# EAGLE schematic RADAR_Main_Board (EAGLE 7.4.0), part 2 of 3
## Sheet 3 of 4: RF
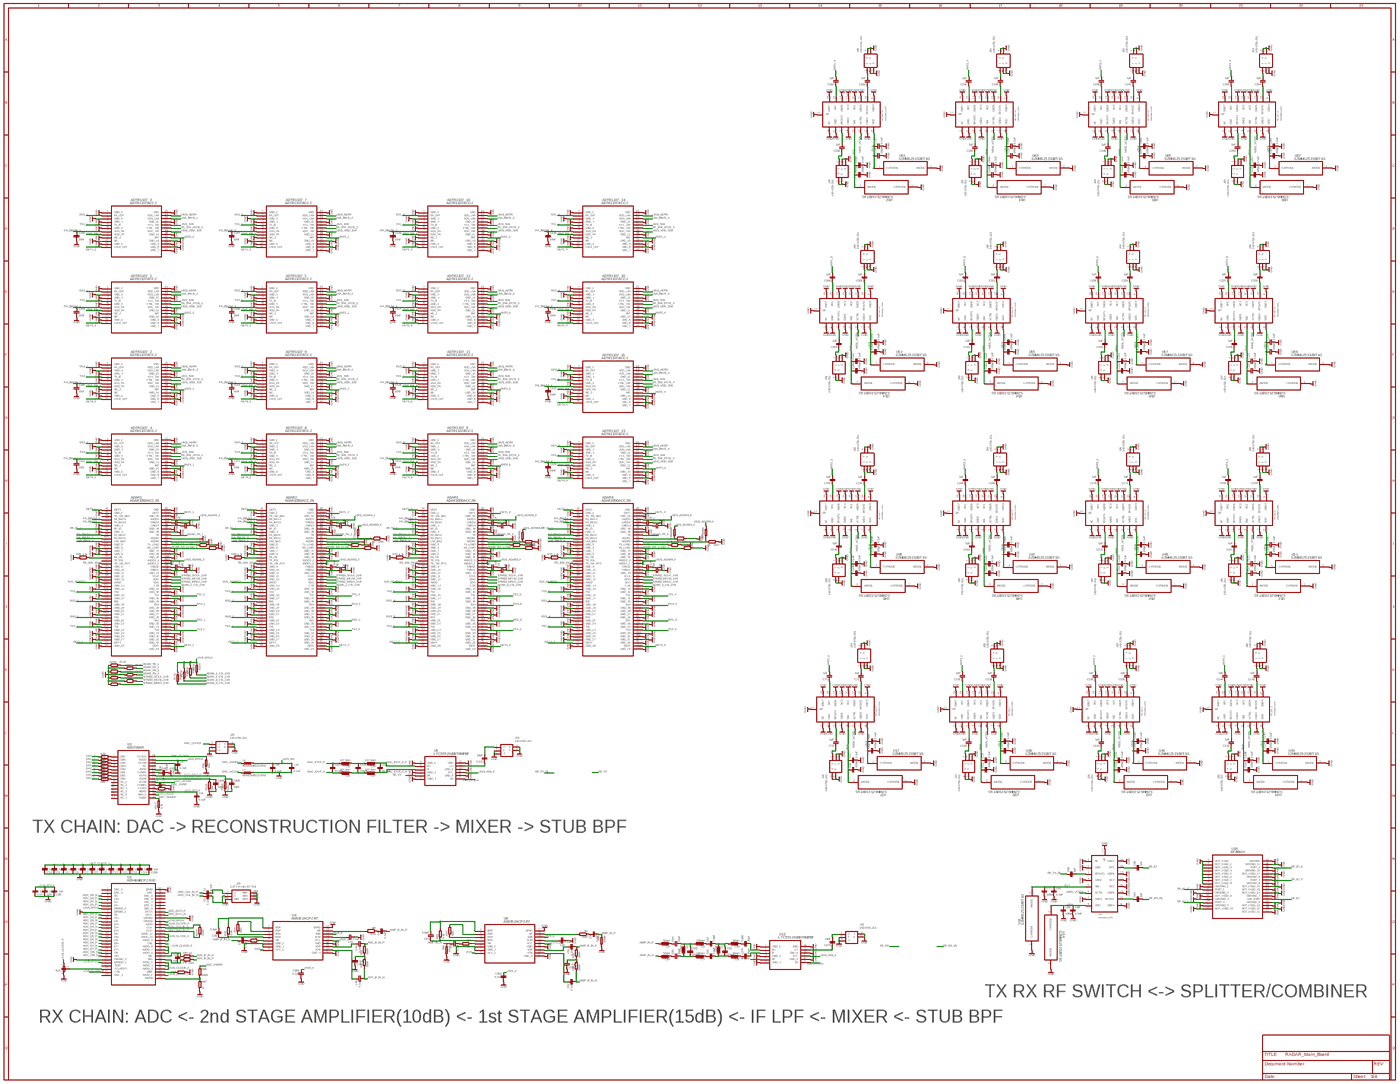
[diagram p7: schematic, sheet 3, overview]
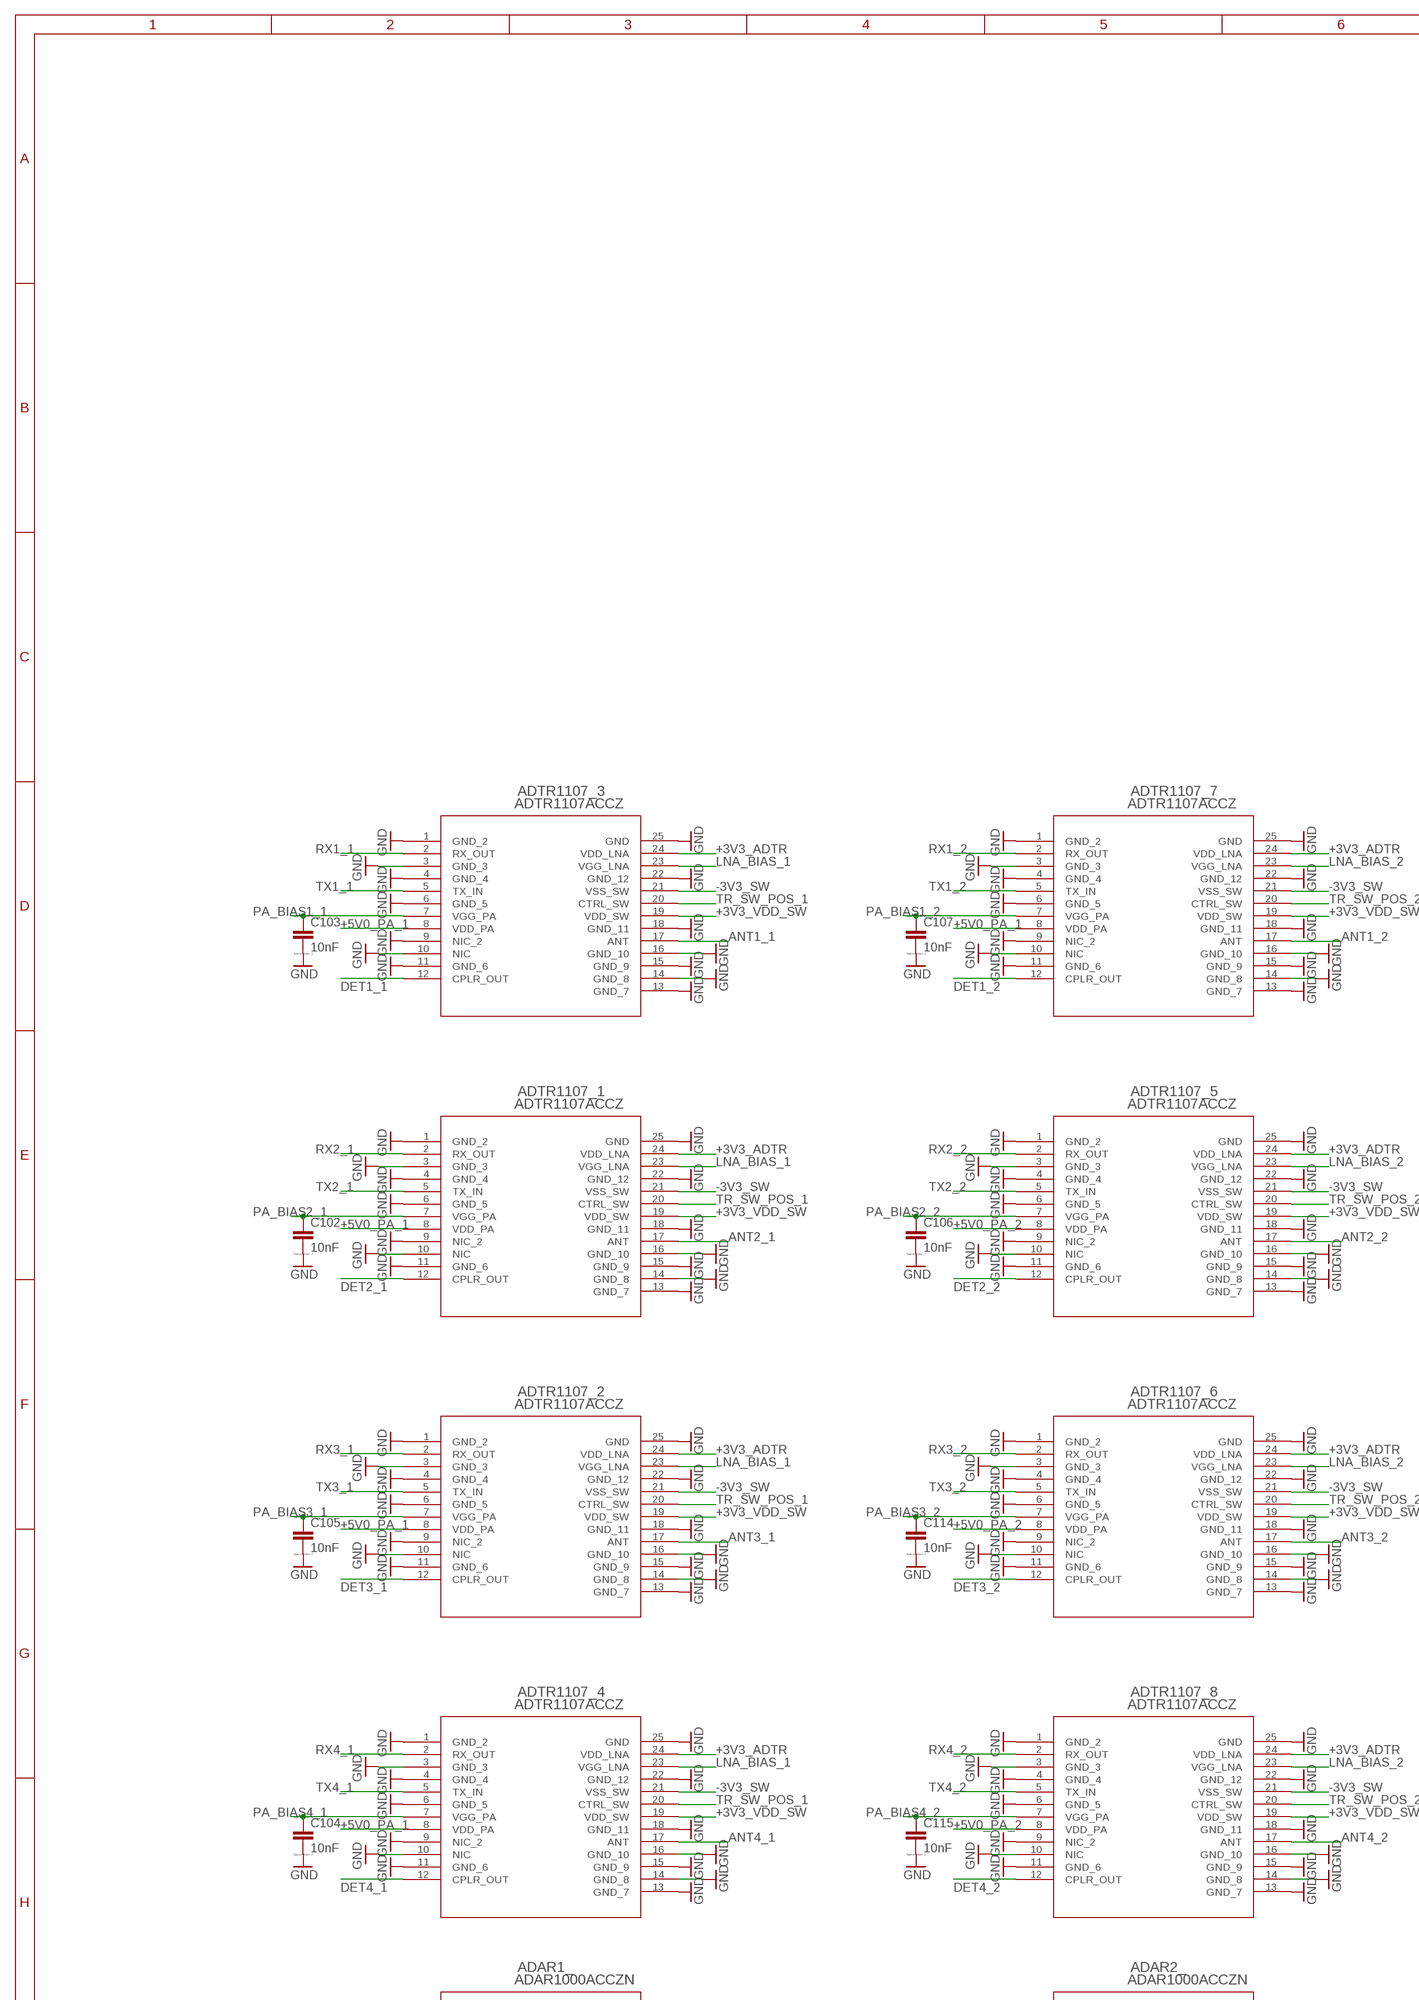
[diagram p8: schematic, sheet 3, part 1 of 8]
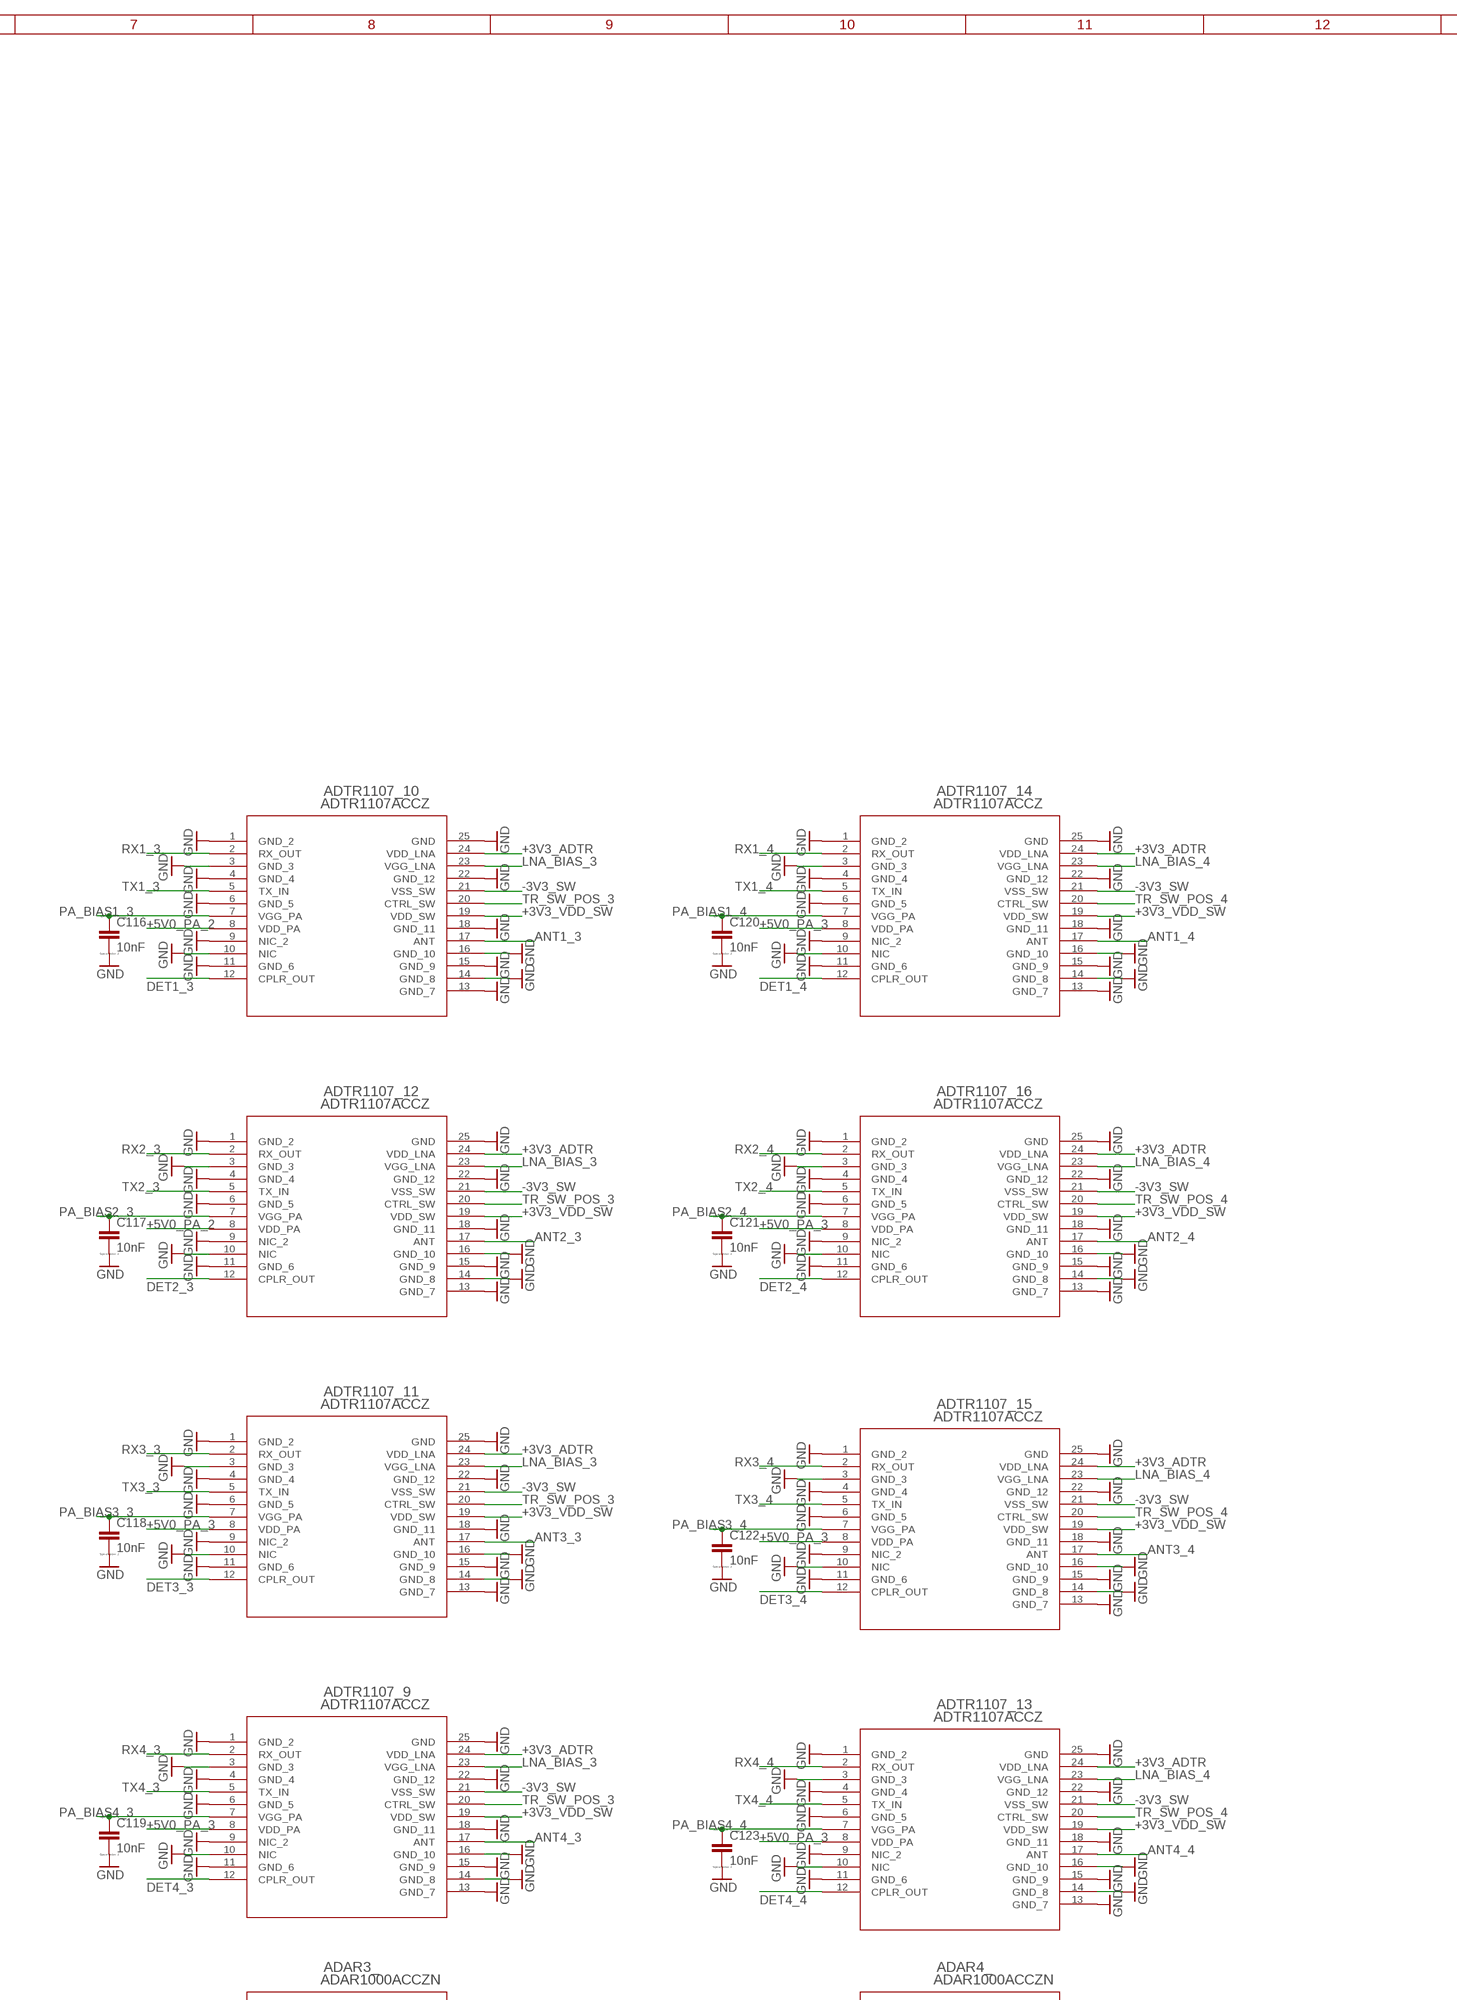
[diagram p9: schematic, sheet 3, part 2 of 8]
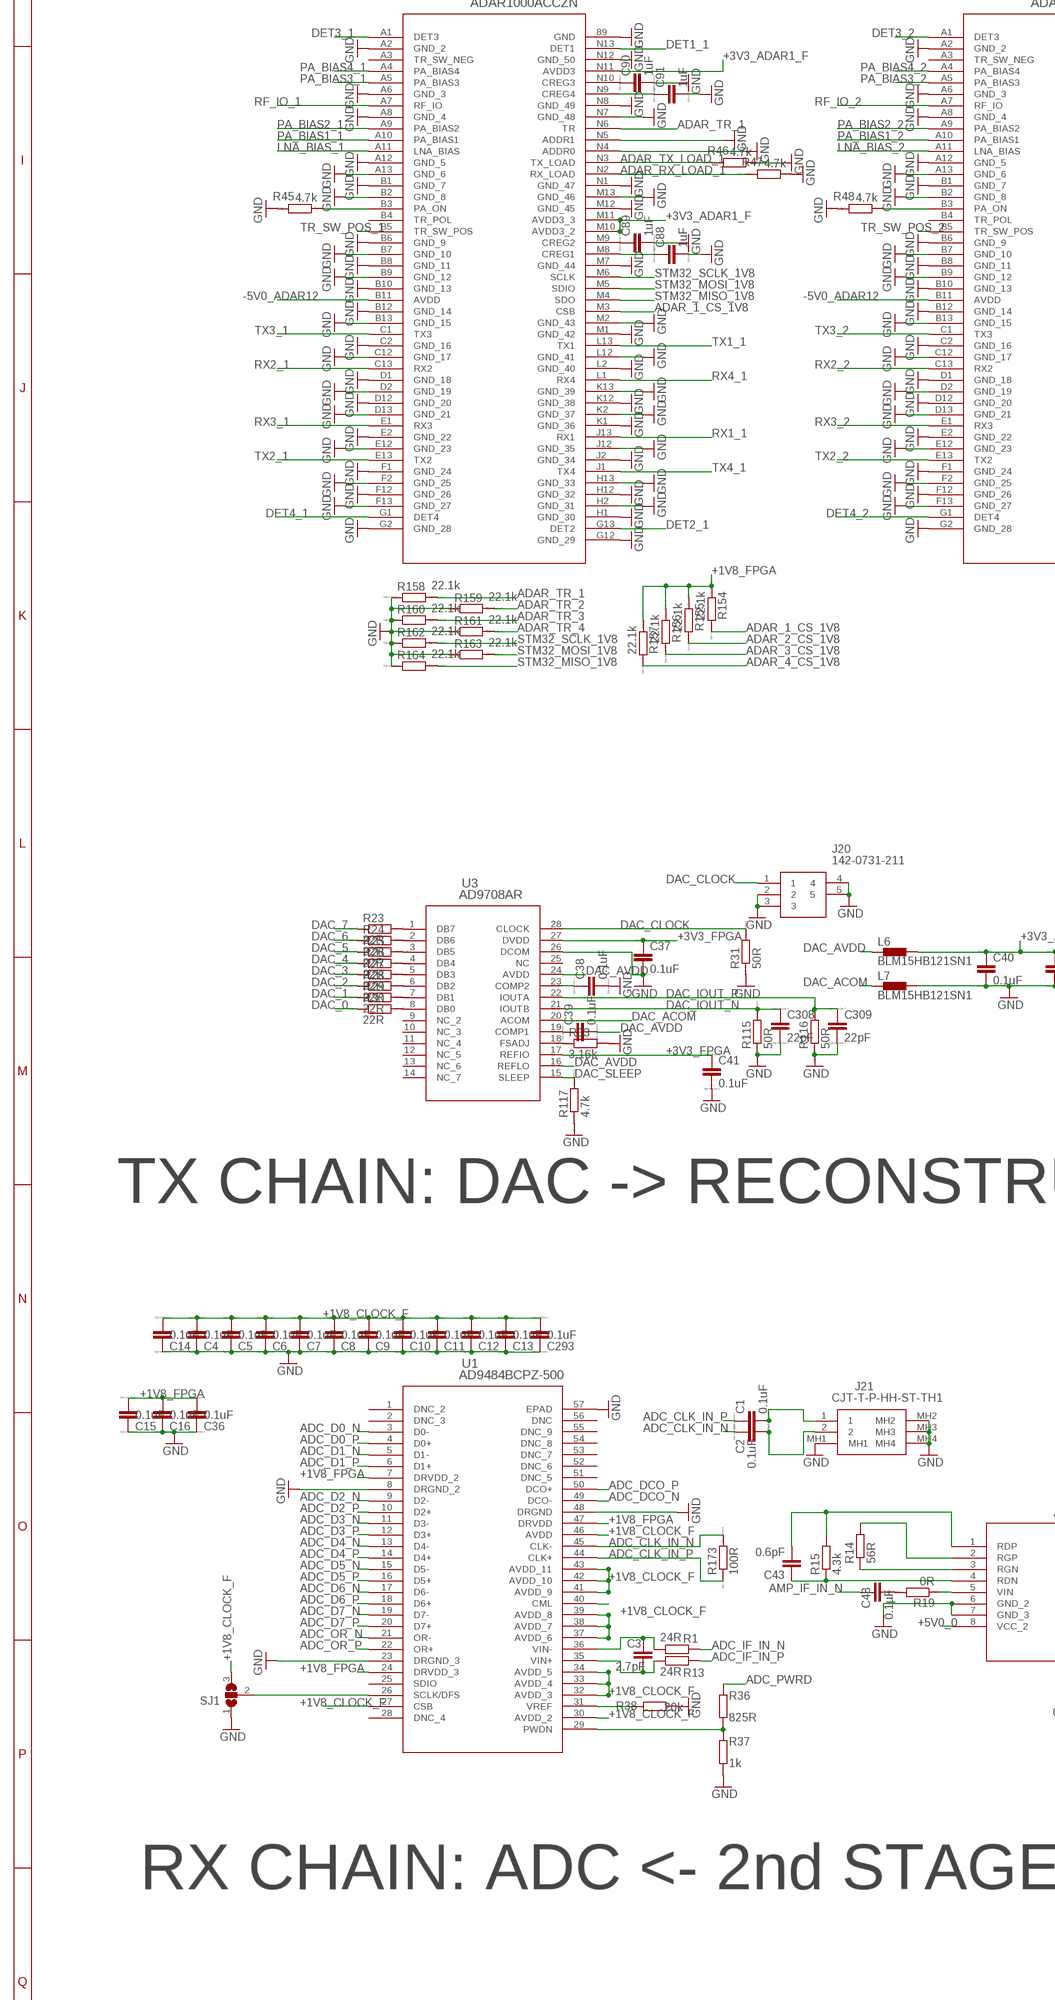
[diagram p10: schematic, sheet 3, part 3 of 8]
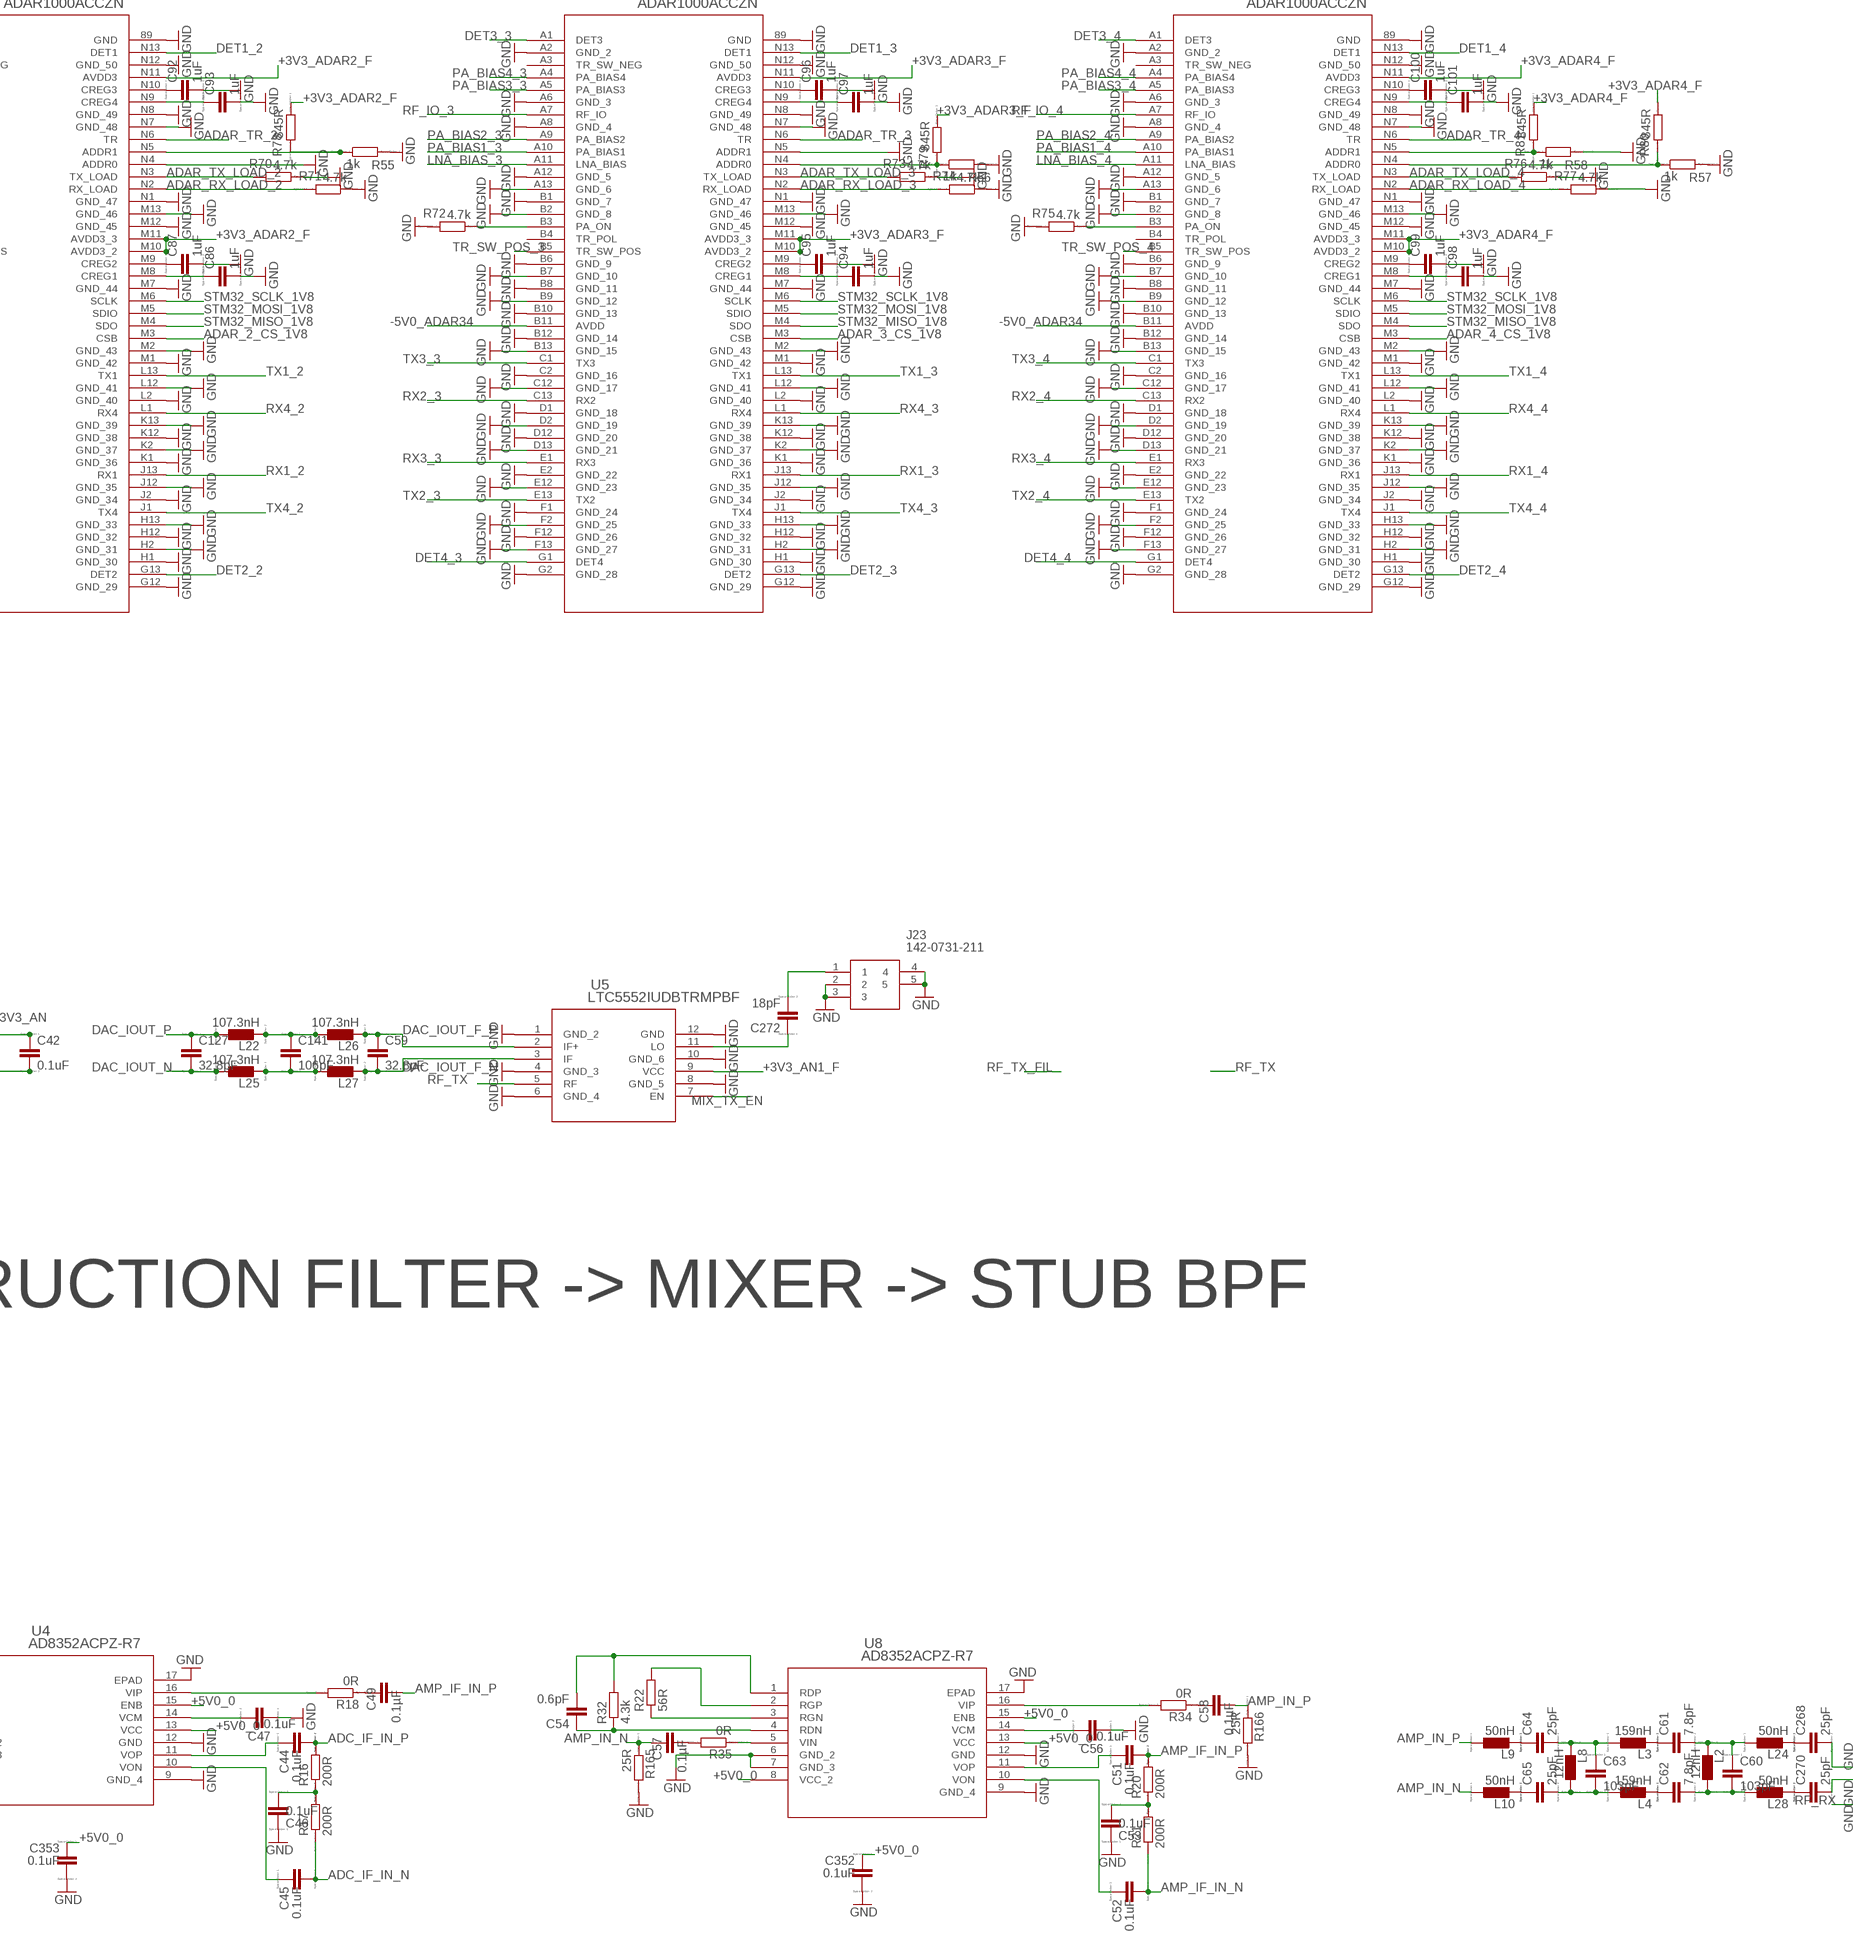
[diagram p11: schematic, sheet 3, part 4 of 8]
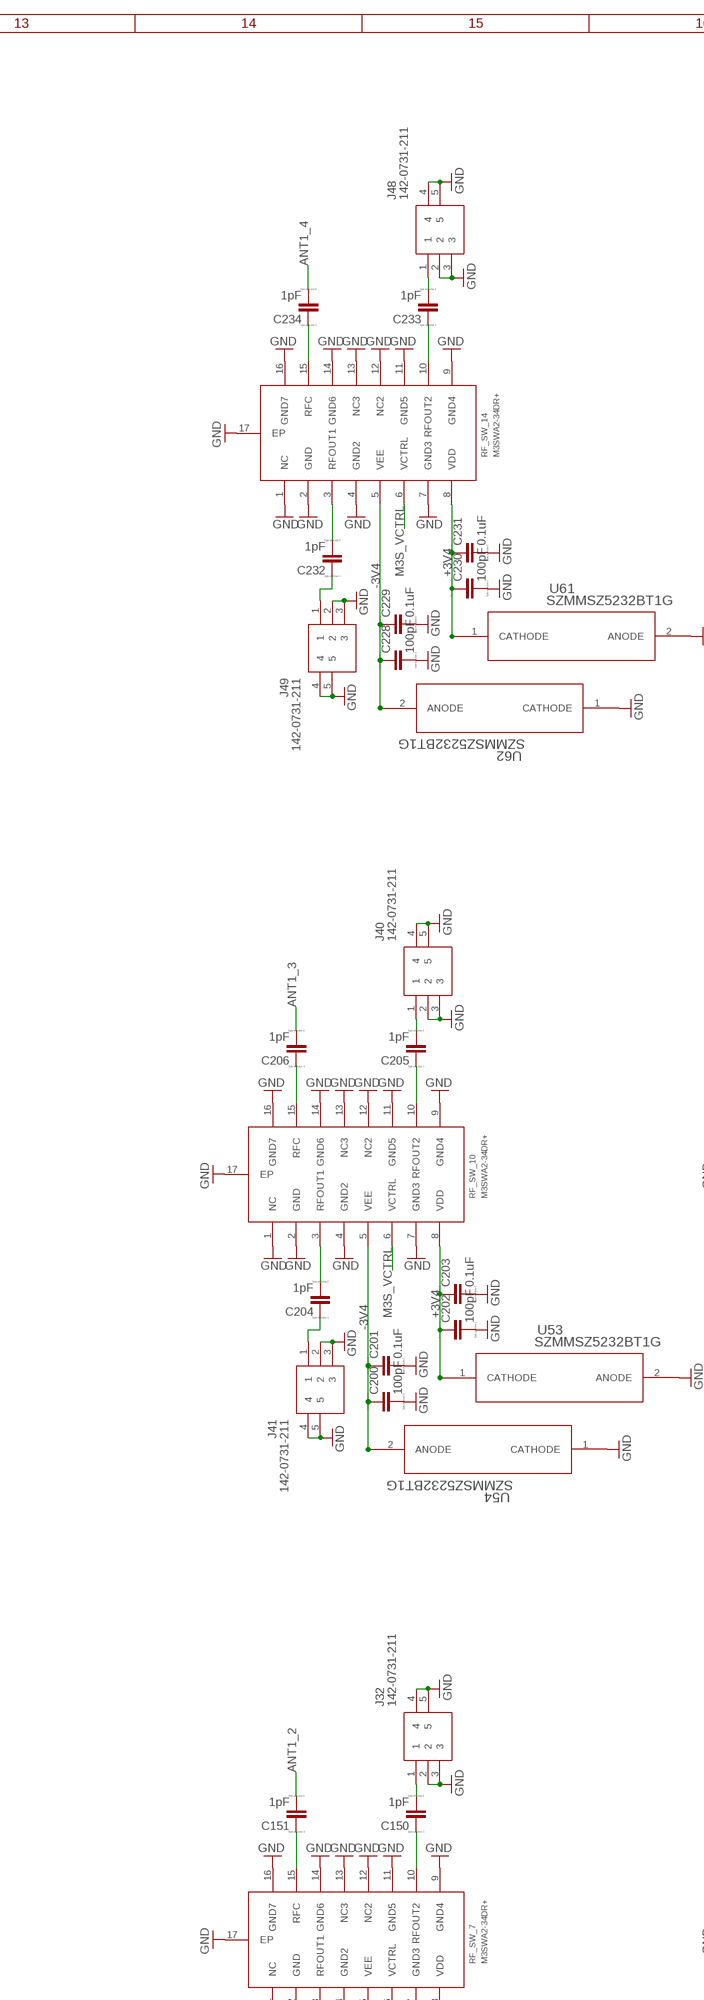
[diagram p12: schematic, sheet 3, part 5 of 8]
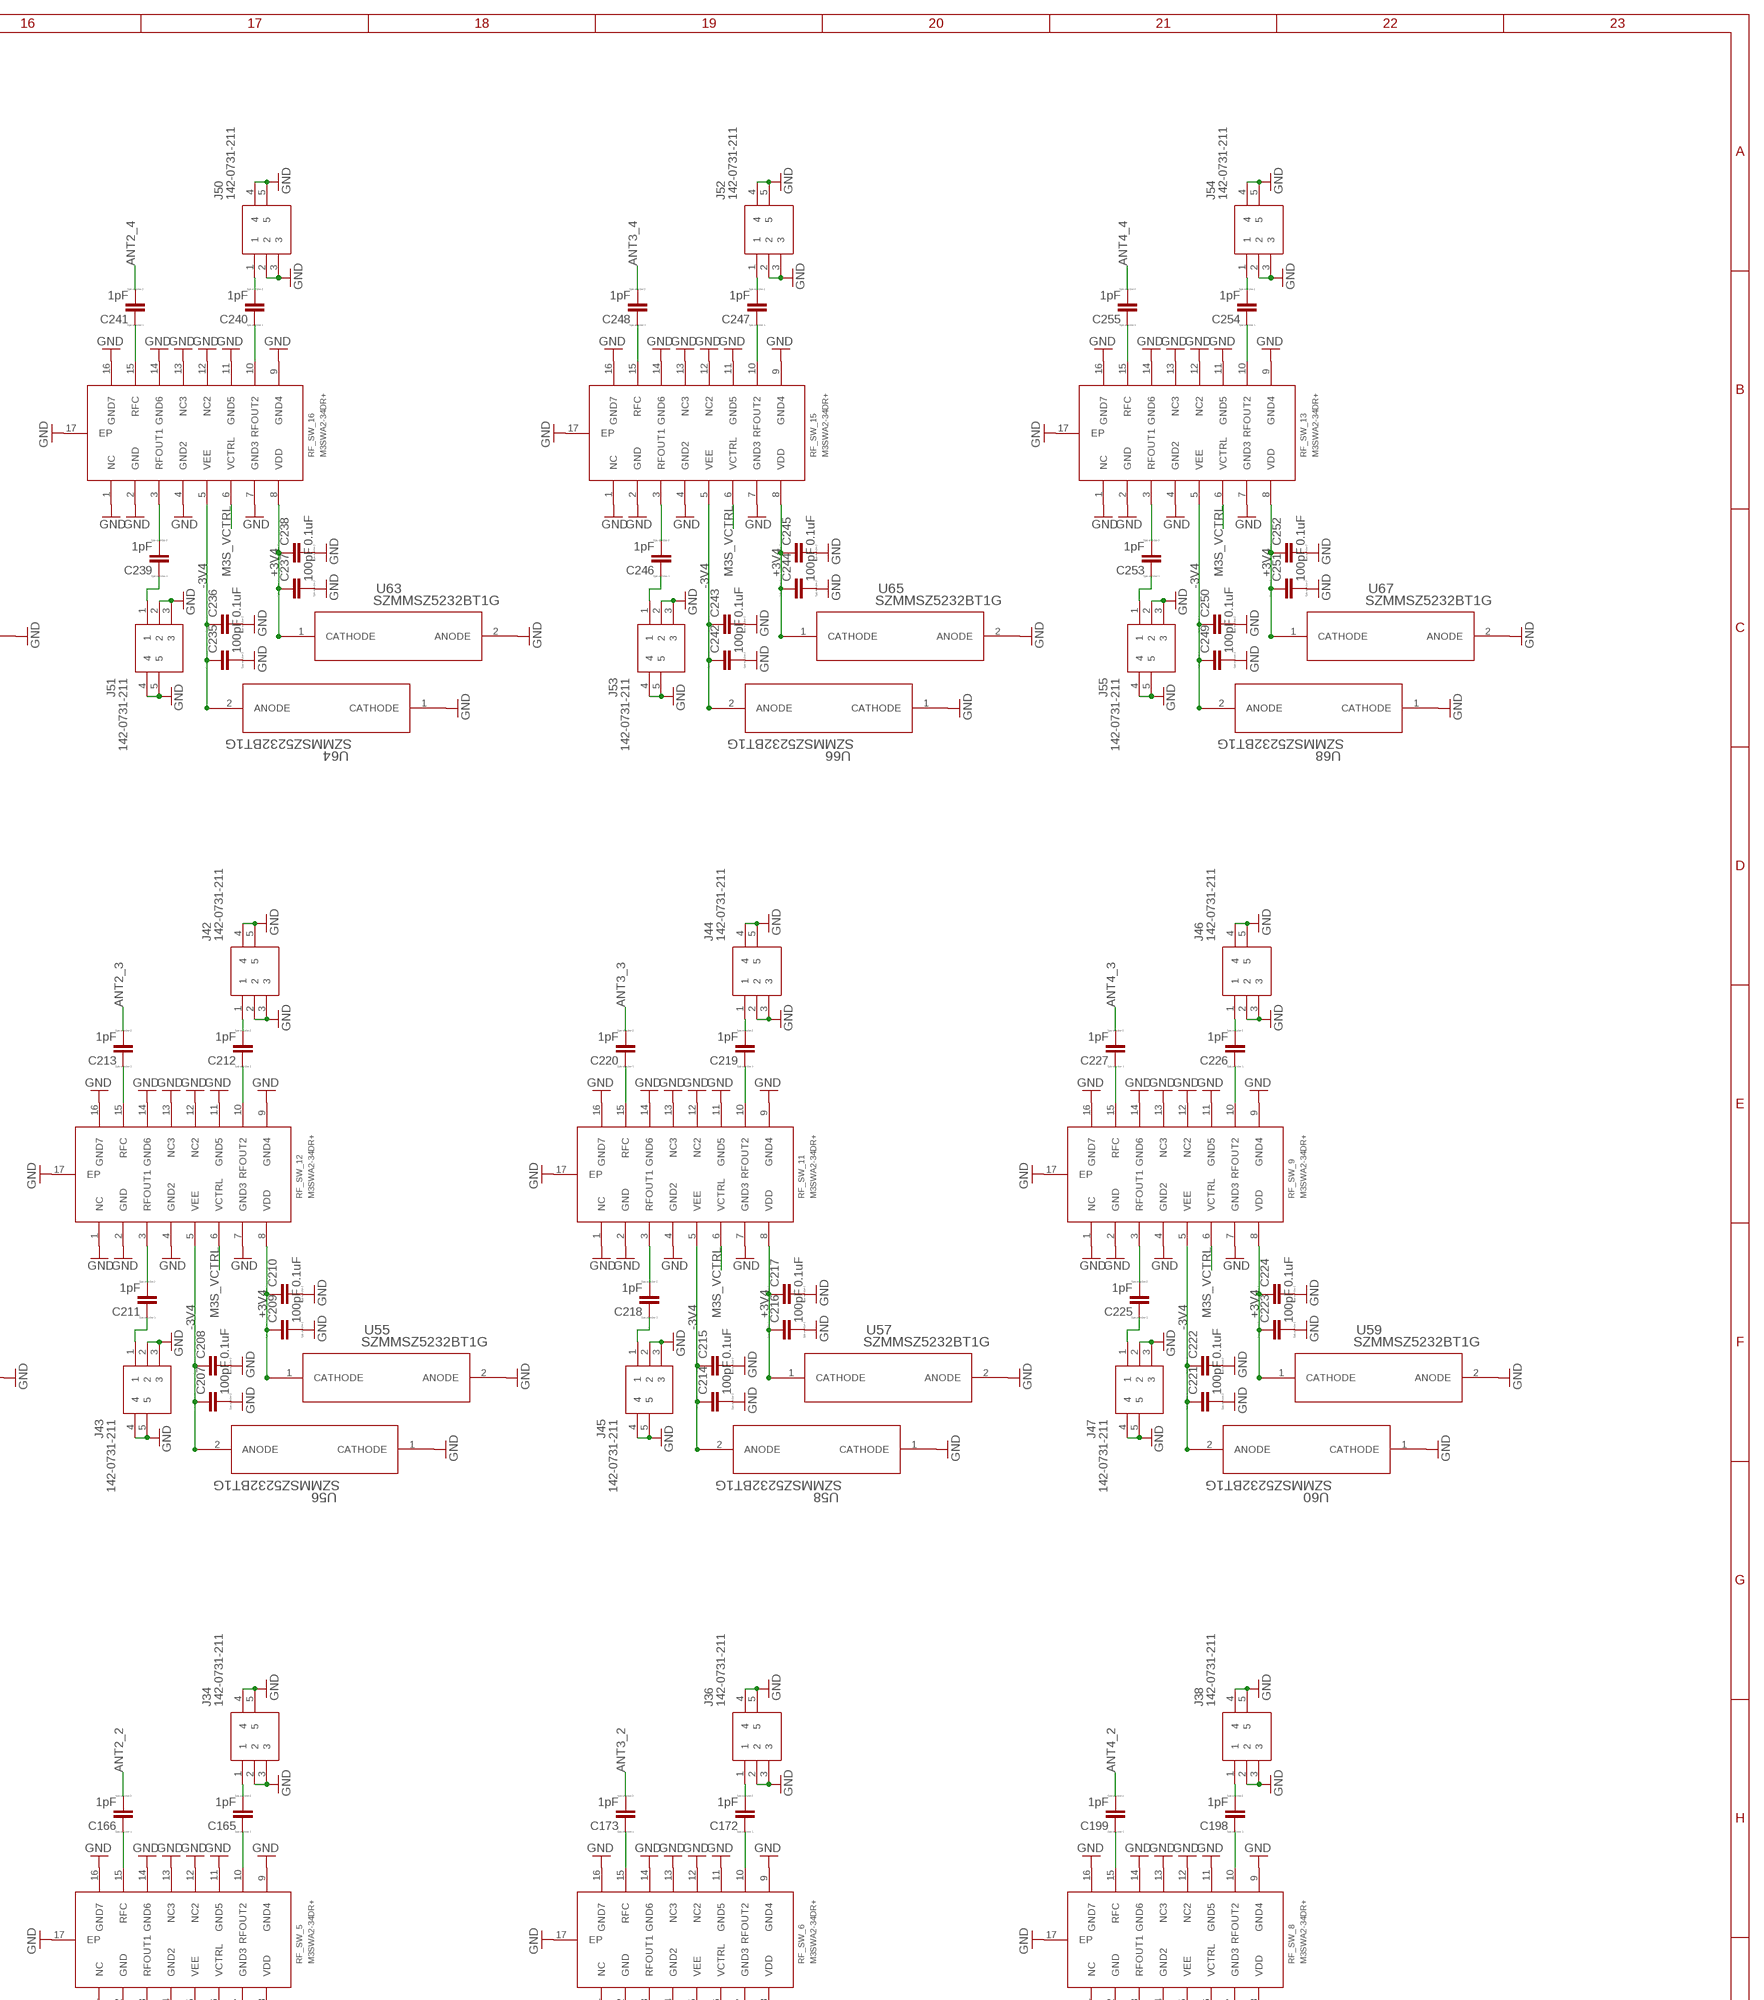
[diagram p13: schematic, sheet 3, part 6 of 8]
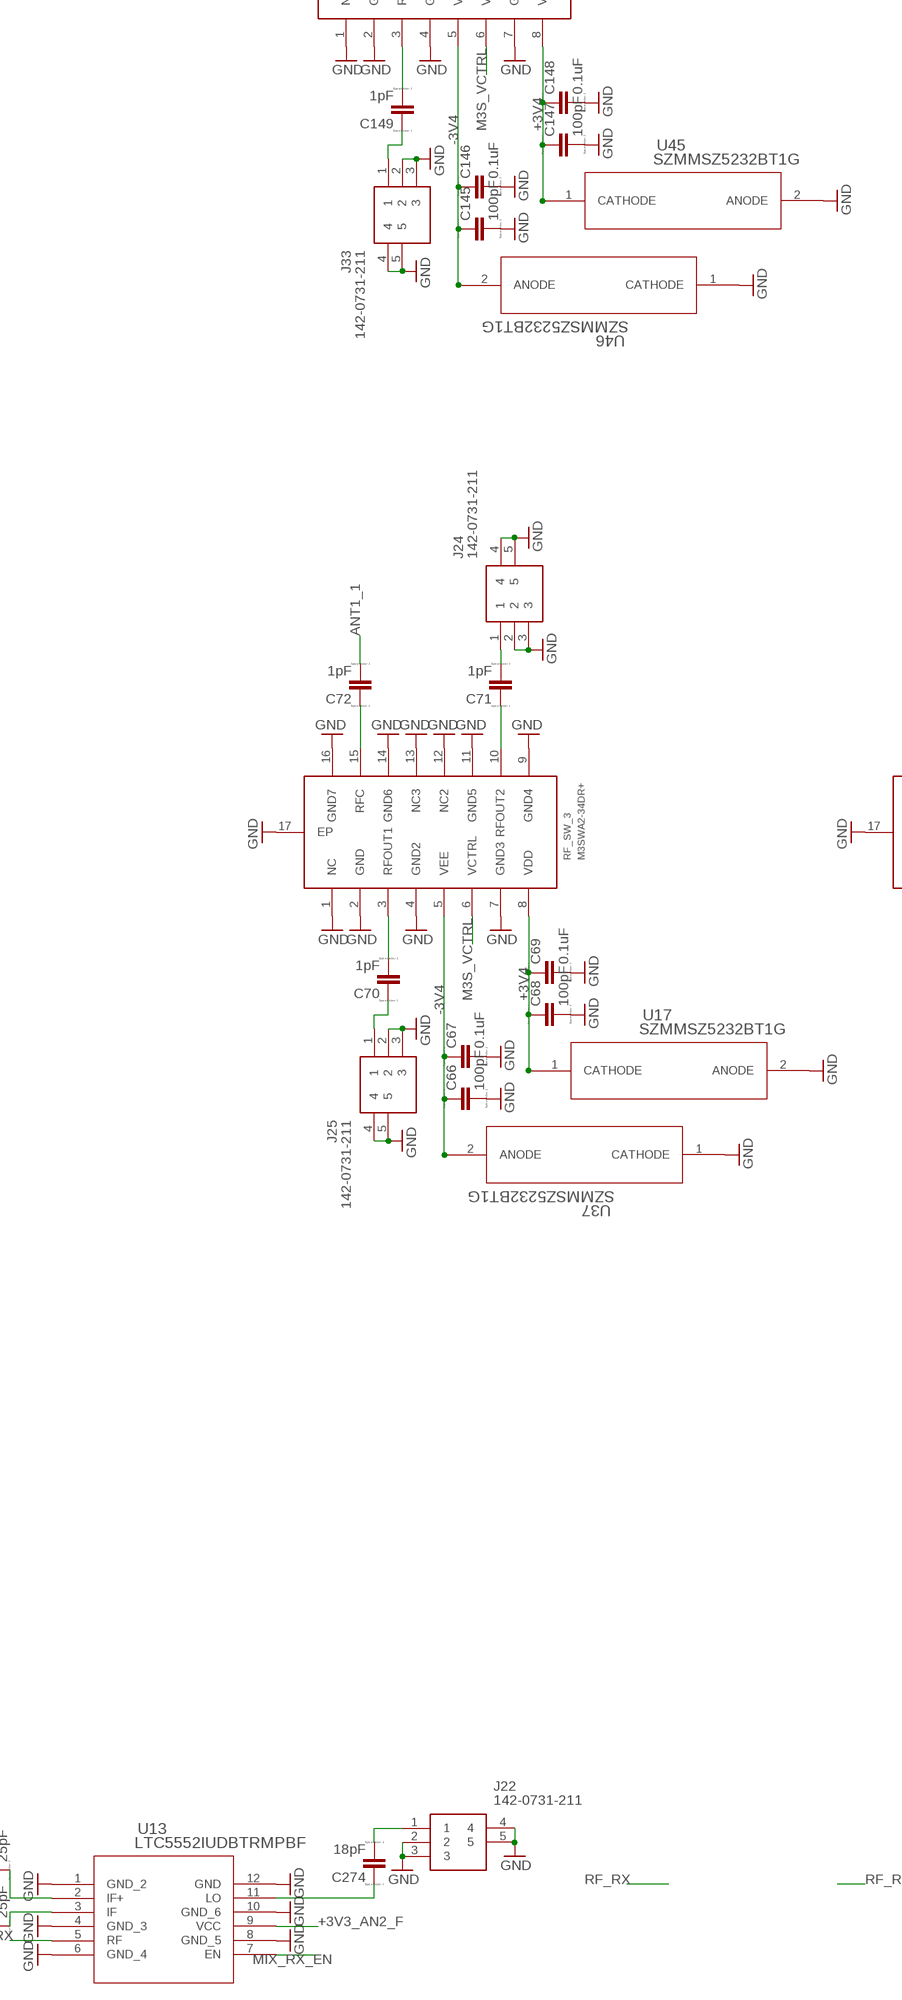
[diagram p14: schematic, sheet 3, part 7 of 8]
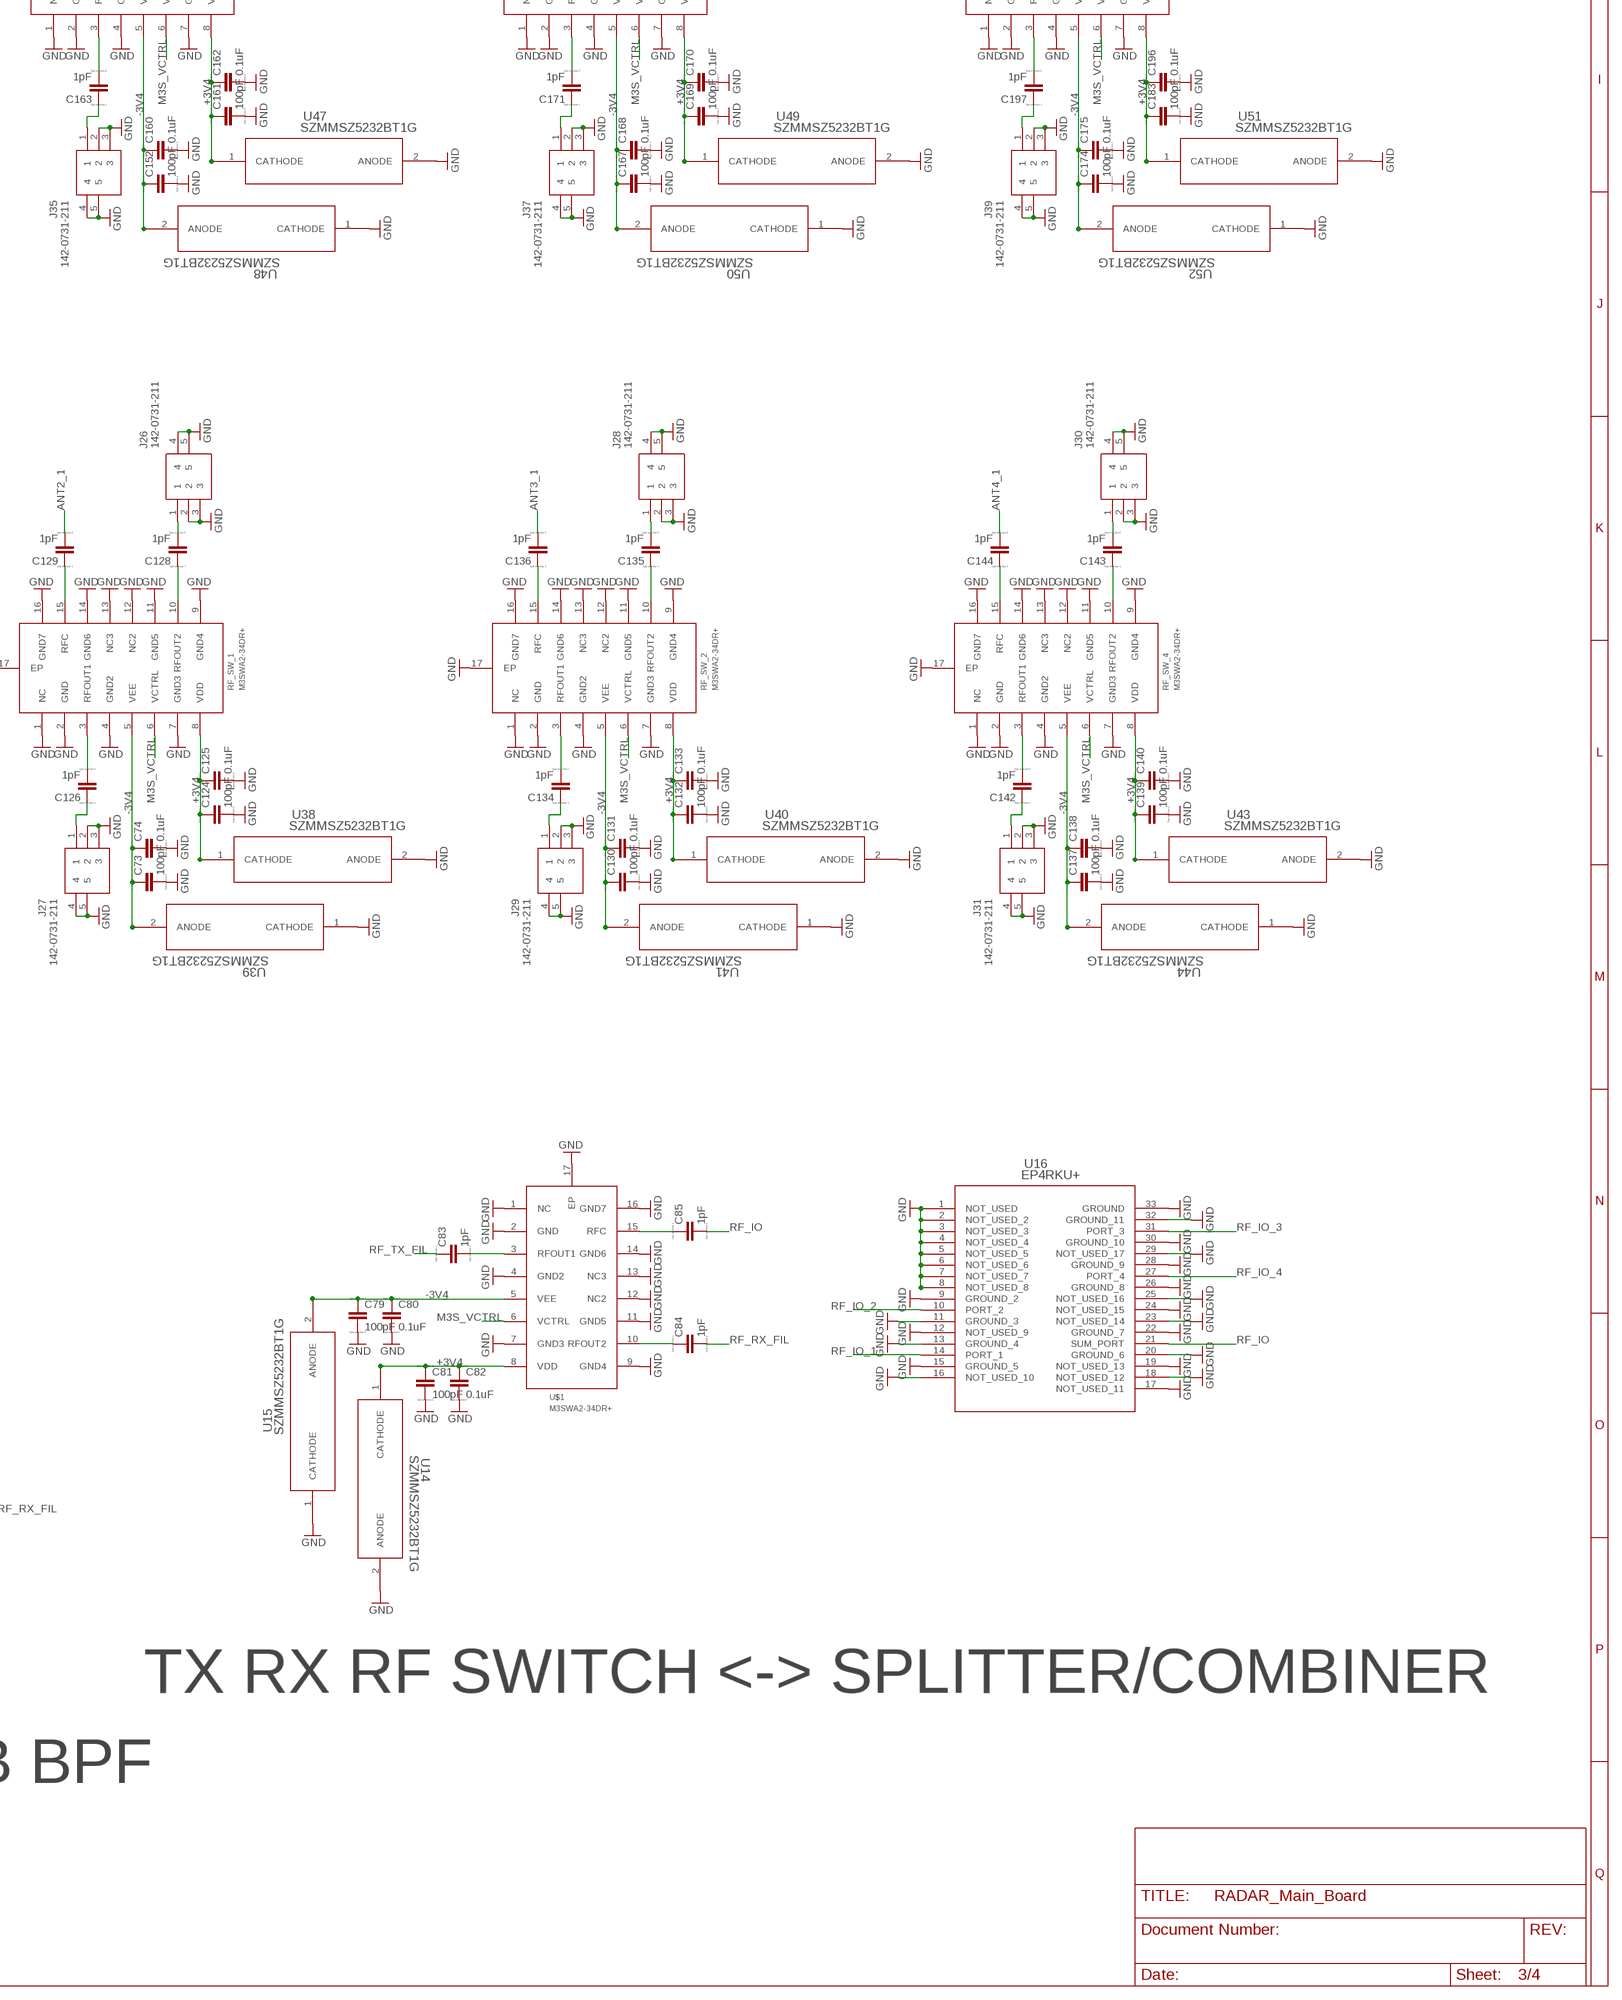
[diagram p15: schematic, sheet 3, part 8 of 8]

### Parts
ADAR1_  ADAR1000ACCZN  [CC-88-1_ADI]
ADAR2_  ADAR1000ACCZN  [CC-88-1_ADI]
ADAR3_  ADAR1000ACCZN  [CC-88-1_ADI]
ADAR4_  ADAR1000ACCZN  [CC-88-1_ADI]
ADTR1107_1  ADTR1107ACCZ  [CC-24-8_ADI]
ADTR1107_2  ADTR1107ACCZ  [CC-24-8_ADI]
ADTR1107_3  ADTR1107ACCZ  [CC-24-8_ADI]
ADTR1107_4  ADTR1107ACCZ  [CC-24-8_ADI]
ADTR1107_5  ADTR1107ACCZ  [CC-24-8_ADI]
ADTR1107_6  ADTR1107ACCZ  [CC-24-8_ADI]
ADTR1107_7  ADTR1107ACCZ  [CC-24-8_ADI]
ADTR1107_8  ADTR1107ACCZ  [CC-24-8_ADI]
ADTR1107_9  ADTR1107ACCZ  [CC-24-8_ADI]
ADTR1107_10  ADTR1107ACCZ  [CC-24-8_ADI]
ADTR1107_11  ADTR1107ACCZ  [CC-24-8_ADI]
ADTR1107_12  ADTR1107ACCZ  [CC-24-8_ADI]
ADTR1107_13  ADTR1107ACCZ  [CC-24-8_ADI]
ADTR1107_14  ADTR1107ACCZ  [CC-24-8_ADI]
ADTR1107_15  ADTR1107ACCZ  [CC-24-8_ADI]
ADTR1107_16  ADTR1107ACCZ  [CC-24-8_ADI]
C1  0.1uF  CC0201  [C0201]
C2  0.1uF  CC0201  [C0201]
C3  2.7pF  C-EUC0402  [C0402]
C4  0.1uF  CC0201  [C0201]
C5  0.1uF  CC0201  [C0201]
C6  0.1uF  CC0201  [C0201]
C7  0.1uF  CC0201  [C0201]
C8  0.1uF  CC0201  [C0201]
C9  0.1uF  CC0201  [C0201]
C10  0.1uF  CC0201  [C0201]
C11  0.1uF  CC0201  [C0201]
C12  0.1uF  CC0201  [C0201]
C13  0.1uF  CC0201  [C0201]
C14  0.1uF  CC0201  [C0201]
C15  0.1uF  CC0201  [C0201]
C16  0.1uF  CC0201  [C0201]
C36  0.1uF  CC0201  [C0201]
C37  0.1uF  CC0201  [C0201]
C38  0.1uF  CC0201  [C0201]
C39  0.1uF  CC0201  [C0201]
C40  0.1uF  CC0201  [C0201]
C41  0.1uF  CC0201  [C0201]
C42  0.1uF  CC0201  [C0201]
C43  0.6pF  C-EUC0201  [C0201]
C44  0.1uF  CC0201  [C0201]
C45  0.1uF  CC0201  [C0201]
C46  0.1uF  CC0201  [C0201]
C47  0.1uF  CC0201  [C0201]
C48  0.1µF  C-EUC0402  [C0402]
C49  0.1µF  C-EUC0402  [C0402]
C51  0.1uF  CC0201  [C0201]
C52  0.1uF  CC0201  [C0201]
C53  0.1uF  CC0201  [C0201]
C54  0.6pF  C-EUC0201  [C0201]
C56  0.1uF  CC0201  [C0201]
C57  0.1µF  C-EUC0402  [C0402]
C58  0.1µF  C-EUC0402  [C0402]
C59  32.8pF  CC0201  [C0201]
C60  103pF  CC0201  [C0201]
C61  7.8pF  CC0201  [C0201]
C62  7.8pF  CC0201  [C0201]
C63  103pF  CC0201  [C0201]
C64  25pF  CC0201  [C0201]
C65  25pF  CC0201  [C0201]
C66  100pF  CC0201  [C0201]
C67  0.1uF  CC0201  [C0201]
C68  100pF  CC0201  [C0201]
C69  0.1uF  CC0201  [C0201]
C70  1pF  CC0201  [C0201]
C71  1pF  CC0201  [C0201]
C72  1pF  CC0201  [C0201]
C73  100pF  CC0201  [C0201]
C74  0.1uF  CC0201  [C0201]
C79  100pF  CC0201  [C0201]
C80  0.1uF  CC0201  [C0201]
C81  100pF  CC0201  [C0201]
C82  0.1uF  CC0201  [C0201]
C83  1pF  CC0201  [C0201]
C84  1pF  CC0201  [C0201]
C85  1pF  CC0201  [C0201]
C86  1uF  CC0201  [C0201]
C87  1uF  CC0201  [C0201]
C88  1uF  CC0201  [C0201]
C89  1uF  CC0201  [C0201]
C90  1uF  CC0201  [C0201]
C91  1uF  CC0201  [C0201]
C92  1uF  CC0201  [C0201]
C93  1uF  CC0201  [C0201]
C94  1uF  CC0201  [C0201]
C95  1uF  CC0201  [C0201]
C96  1uF  CC0201  [C0201]
C97  1uF  CC0201  [C0201]
C98  1uF  CC0201  [C0201]
C99  1uF  CC0201  [C0201]
C100  1uF  CC0201  [C0201]
C101  1uF  CC0201  [C0201]
C102  10nF  CC0201  [C0201]
C103  10nF  CC0201  [C0201]
C104  10nF  CC0201  [C0201]
C105  10nF  CC0201  [C0201]
C106  10nF  CC0201  [C0201]
C107  10nF  CC0201  [C0201]
C114  10nF  CC0201  [C0201]
C115  10nF  CC0201  [C0201]
C116  10nF  CC0201  [C0201]
C117  10nF  CC0201  [C0201]
C118  10nF  CC0201  [C0201]
C119  10nF  CC0201  [C0201]
C120  10nF  CC0201  [C0201]
C121  10nF  CC0201  [C0201]
C122  10nF  CC0201  [C0201]
C123  10nF  CC0201  [C0201]
C124  100pF  CC0201  [C0201]
C125  0.1uF  CC0201  [C0201]
C126  1pF  CC0201  [C0201]
C127  32.8pF  CC0201  [C0201]
C128  1pF  CC0201  [C0201]
C129  1pF  CC0201  [C0201]
C130  100pF  CC0201  [C0201]
C131  0.1uF  CC0201  [C0201]
C132  100pF  CC0201  [C0201]
C133  0.1uF  CC0201  [C0201]
C134  1pF  CC0201  [C0201]
C135  1pF  CC0201  [C0201]
C136  1pF  CC0201  [C0201]
C137  100pF  CC0201  [C0201]
C138  0.1uF  CC0201  [C0201]
C139  100pF  CC0201  [C0201]
C140  0.1uF  CC0201  [C0201]
C141  106pF  CC0201  [C0201]
C142  1pF  CC0201  [C0201]
C143  1pF  CC0201  [C0201]
C144  1pF  CC0201  [C0201]
C145  100pF  CC0201  [C0201]
C146  0.1uF  CC0201  [C0201]
C147  100pF  CC0201  [C0201]
C148  0.1uF  CC0201  [C0201]
C149  1pF  CC0201  [C0201]
C150  1pF  CC0201  [C0201]
C151  1pF  CC0201  [C0201]
C152  100pF  CC0201  [C0201]
C160  0.1uF  CC0201  [C0201]
C161  100pF  CC0201  [C0201]
C162  0.1uF  CC0201  [C0201]
C163  1pF  CC0201  [C0201]
C165  1pF  CC0201  [C0201]
C166  1pF  CC0201  [C0201]
C167  100pF  CC0201  [C0201]
C168  0.1uF  CC0201  [C0201]
C169  100pF  CC0201  [C0201]
C170  0.1uF  CC0201  [C0201]
C171  1pF  CC0201  [C0201]
C172  1pF  CC0201  [C0201]
C173  1pF  CC0201  [C0201]
C174  100pF  CC0201  [C0201]
C175  0.1uF  CC0201  [C0201]
C183  100pF  CC0201  [C0201]
C196  0.1uF  CC0201  [C0201]
C197  1pF  CC0201  [C0201]
C198  1pF  CC0201  [C0201]
C199  1pF  CC0201  [C0201]
C200  100pF  CC0201  [C0201]
C201  0.1uF  CC0201  [C0201]
C202  100pF  CC0201  [C0201]
C203  0.1uF  CC0201  [C0201]
C204  1pF  CC0201  [C0201]
C205  1pF  CC0201  [C0201]
C206  1pF  CC0201  [C0201]
C207  100pF  CC0201  [C0201]
C208  0.1uF  CC0201  [C0201]
C209  100pF  CC0201  [C0201]
C210  0.1uF  CC0201  [C0201]
C211  1pF  CC0201  [C0201]
C212  1pF  CC0201  [C0201]
C213  1pF  CC0201  [C0201]
C214  100pF  CC0201  [C0201]
C215  0.1uF  CC0201  [C0201]
C216  100pF  CC0201  [C0201]
C217  0.1uF  CC0201  [C0201]
C218  1pF  CC0201  [C0201]
C219  1pF  CC0201  [C0201]
C220  1pF  CC0201  [C0201]
C221  100pF  CC0201  [C0201]
C222  0.1uF  CC0201  [C0201]
C223  100pF  CC0201  [C0201]
C224  0.1uF  CC0201  [C0201]
C225  1pF  CC0201  [C0201]
C226  1pF  CC0201  [C0201]
C227  1pF  CC0201  [C0201]
C228  100pF  CC0201  [C0201]
C229  0.1uF  CC0201  [C0201]
C230  100pF  CC0201  [C0201]
C231  0.1uF  CC0201  [C0201]
C232  1pF  CC0201  [C0201]
C233  1pF  CC0201  [C0201]
C234  1pF  CC0201  [C0201]
C235  100pF  CC0201  [C0201]
C236  0.1uF  CC0201  [C0201]
C237  100pF  CC0201  [C0201]
C238  0.1uF  CC0201  [C0201]
C239  1pF  CC0201  [C0201]
C240  1pF  CC0201  [C0201]
C241  1pF  CC0201  [C0201]
C242  100pF  CC0201  [C0201]
C243  0.1uF  CC0201  [C0201]
C244  100pF  CC0201  [C0201]
C245  0.1uF  CC0201  [C0201]
C246  1pF  CC0201  [C0201]
C247  1pF  CC0201  [C0201]
C248  1pF  CC0201  [C0201]
C249  100pF  CC0201  [C0201]
C250  0.1uF  CC0201  [C0201]
C251  100pF  CC0201  [C0201]
C252  0.1uF  CC0201  [C0201]
C253  1pF  CC0201  [C0201]
C254  1pF  CC0201  [C0201]
C255  1pF  CC0201  [C0201]
C268  25pF  CC0201  [C0201]
C270  25pF  CC0201  [C0201]
C272  18pF  CC0201  [C0201]
C274  18pF  CC0201  [C0201]
C293  0.1uF  CC0201  [C0201]
C308  22pF  CC0201  [C0201]
C309  22pF  CC0201  [C0201]
C352  0.1uF  CC0201  [C0201]
C353  0.1uF  CC0201  [C0201]
J20  142-0731-211  [1420731211]
J21  CJT-T-P-HH-ST-TH1  [CJTTPHHSTTH1]
J22  142-0731-211  [1420731211]
J23  142-0731-211  [1420731211]
J24  142-0731-211  [1420731211]
J25  142-0731-211  [1420731211]
J26  142-0731-211  [1420731211]
J27  142-0731-211  [1420731211]
J28  142-0731-211  [1420731211]
J29  142-0731-211  [1420731211]
J30  142-0731-211  [1420731211]
J31  142-0731-211  [1420731211]
J32  142-0731-211  [1420731211]
J33  142-0731-211  [1420731211]
J34  142-0731-211  [1420731211]
J35  142-0731-211  [1420731211]
J36  142-0731-211  [1420731211]
J37  142-0731-211  [1420731211]
J38  142-0731-211  [1420731211]
J39  142-0731-211  [1420731211]
J40  142-0731-211  [1420731211]
J41  142-0731-211  [1420731211]
J42  142-0731-211  [1420731211]
J43  142-0731-211  [1420731211]
J44  142-0731-211  [1420731211]
J45  142-0731-211  [1420731211]
J46  142-0731-211  [1420731211]
J47  142-0731-211  [1420731211]
J48  142-0731-211  [1420731211]
J49  142-0731-211  [1420731211]
J50  142-0731-211  [1420731211]
J51  142-0731-211  [1420731211]
J52  142-0731-211  [1420731211]
J53  142-0731-211  [1420731211]
J54  142-0731-211  [1420731211]
J55  142-0731-211  [1420731211]
L2  12nH  LL0201  [L0201]
L3  159nH  LL0201  [L0201]
L4  159nH  LL0201  [L0201]
L6  BLM15HB121SN1  [0402]
L7  BLM15HB121SN1  [0402]
L8  12nH  LL0201  [L0201]
L9  50nH  LL0201  [L0201]
L10  50nH  LL0201  [L0201]
L22  107.3nH  LL0201  [L0201]
L24  50nH  LL0201  [L0201]
L25  107.3nH  LL0201  [L0201]
L26  107.3nH  LL0201  [L0201]
L27  107.3nH  LL0201  [L0201]
L28  50nH  LL0201  [L0201]
R1  24R  R-EU_R0402  [R0402]
R13  24R  R-EU_R0402  [R0402]
R14  56R  R-EU_R0201  [R0201]
R15  4.3k  R-EU_R0201  [R0201]
R16  200R  RR0201  [R0201]
R17  200R  RR0201  [R0201]
R18  0R  RR0201  [R0201]
R19  0R  RR0201  [R0201]
R20  200R  RR0201  [R0201]
R21  200R  RR0201  [R0201]
R22  56R  R-EU_R0201  [R0201]
R23  22R  RR0201  [R0201]
R24  22R  RR0201  [R0201]
R25  22R  RR0201  [R0201]
R26  22R  RR0201  [R0201]
R27  22R  RR0201  [R0201]
R28  22R  RR0201  [R0201]
R29  22R  RR0201  [R0201]
R30  22R  RR0201  [R0201]
R31  50R  RR0201  [R0201]
R32  4.3k  R-EU_R0201  [R0201]
R33  3.16k  RR0201  [R0201]
R34  0R  RR0201  [R0201]
R35  0R  RR0201  [R0201]
R36  825R  R-EU_R0402  [R0402]
R37  1k  R-EU_R0402  [R0402]
R38  20k  R-EU_R0402  [R0402]
R45  4.7k  RR0201  [R0201]
R46  4.7k  RR0201  [R0201]
R47  4.7k  RR0201  [R0201]
R48  4.7k  RR0201  [R0201]
R55  1k  RR0201  [R0201]
R56  1k  RR0201  [R0201]
R57  1k  RR0201  [R0201]
R58  1k  RR0201  [R0201]
R70  4.7k  RR0201  [R0201]
R71  4.7k  RR0201  [R0201]
R72  4.7k  RR0201  [R0201]
R73  4.7k  RR0201  [R0201]
R74  4.7k  RR0201  [R0201]
R75  4.7k  RR0201  [R0201]
R76  4.7k  RR0201  [R0201]
R77  4.7k  RR0201  [R0201]
R78  845R  RR0201  [R0201]
R79  845R  RR0201  [R0201]
R80  845R  RR0201  [R0201]
R81  845R  RR0201  [R0201]
R115  50R  RR0201  [R0201]
R116  50R  RR0201  [R0201]
R117  4.7k  RR0201  [R0201]
R154  22.1k  RR0201  [R0201]
R155  22.1k  RR0201  [R0201]
R156  22.1k  RR0201  [R0201]
R157  22.1k  RR0201  [R0201]
R158  22.1k  RR0201  [R0201]
R159  22.1k  RR0201  [R0201]
R160  22.1k  RR0201  [R0201]
R161  22.1k  RR0201  [R0201]
R162  22.1k  RR0201  [R0201]
R163  22.1k  RR0201  [R0201]
R164  22.1k  RR0201  [R0201]
R165  25R  RR0201  [R0201]
R166  25R  RR0201  [R0201]
R173  100R  RR0201  [R0201]
RF_SW_1  M3SWA2-34DR+  [16_QFN]
RF_SW_2  M3SWA2-34DR+  [16_QFN]
RF_SW_3  M3SWA2-34DR+  [16_QFN]
RF_SW_4  M3SWA2-34DR+  [16_QFN]
RF_SW_5  M3SWA2-34DR+  [16_QFN]
RF_SW_6  M3SWA2-34DR+  [16_QFN]
RF_SW_7  M3SWA2-34DR+  [16_QFN]
RF_SW_8  M3SWA2-34DR+  [16_QFN]
RF_SW_9  M3SWA2-34DR+  [16_QFN]
RF_SW_10  M3SWA2-34DR+  [16_QFN]
RF_SW_11  M3SWA2-34DR+  [16_QFN]
RF_SW_12  M3SWA2-34DR+  [16_QFN]
RF_SW_13  M3SWA2-34DR+  [16_QFN]
RF_SW_14  M3SWA2-34DR+  [16_QFN]
RF_SW_15  M3SWA2-34DR+  [16_QFN]
RF_SW_16  M3SWA2-34DR+  [16_QFN]
SJ1  SJ2W  [SJ_2]
U1  AD9484BCPZ-500  [CP_56_5_ADI]
U3  AD9708AR  [RW_28_ADI]
U4  AD8352ACPZ-R7  [CP_16_3_ADI]
U5  LTC5552IUDBTRMPBF  [UDB_12_ADI]
U8  AD8352ACPZ-R7  [CP_16_3_ADI]
U13  LTC5552IUDBTRMPBF  [UDB_12_ADI]
U14  SZMMSZ5232BT1G  [SOD-123_ONS]
U15  SZMMSZ5232BT1G  [SOD-123_ONS]
U16  EP4RKU+  [DG1677-2_MNC]
U17  SZMMSZ5232BT1G  [SOD-123_ONS]
U37  SZMMSZ5232BT1G  [SOD-123_ONS]
U38  SZMMSZ5232BT1G  [SOD-123_ONS]
U39  SZMMSZ5232BT1G  [SOD-123_ONS]
U40  SZMMSZ5232BT1G  [SOD-123_ONS]
U41  SZMMSZ5232BT1G  [SOD-123_ONS]
U43  SZMMSZ5232BT1G  [SOD-123_ONS]
U44  SZMMSZ5232BT1G  [SOD-123_ONS]
U45  SZMMSZ5232BT1G  [SOD-123_ONS]
U46  SZMMSZ5232BT1G  [SOD-123_ONS]
U47  SZMMSZ5232BT1G  [SOD-123_ONS]
U48  SZMMSZ5232BT1G  [SOD-123_ONS]
U49  SZMMSZ5232BT1G  [SOD-123_ONS]
U50  SZMMSZ5232BT1G  [SOD-123_ONS]
U51  SZMMSZ5232BT1G  [SOD-123_ONS]
U52  SZMMSZ5232BT1G  [SOD-123_ONS]
U53  SZMMSZ5232BT1G  [SOD-123_ONS]
U54  SZMMSZ5232BT1G  [SOD-123_ONS]
U55  SZMMSZ5232BT1G  [SOD-123_ONS]
U56  SZMMSZ5232BT1G  [SOD-123_ONS]
U57  SZMMSZ5232BT1G  [SOD-123_ONS]
U58  SZMMSZ5232BT1G  [SOD-123_ONS]
U59  SZMMSZ5232BT1G  [SOD-123_ONS]
U60  SZMMSZ5232BT1G  [SOD-123_ONS]
U61  SZMMSZ5232BT1G  [SOD-123_ONS]
U62  SZMMSZ5232BT1G  [SOD-123_ONS]
U63  SZMMSZ5232BT1G  [SOD-123_ONS]
U64  SZMMSZ5232BT1G  [SOD-123_ONS]
U65  SZMMSZ5232BT1G  [SOD-123_ONS]
U66  SZMMSZ5232BT1G  [SOD-123_ONS]
U67  SZMMSZ5232BT1G  [SOD-123_ONS]
U68  SZMMSZ5232BT1G  [SOD-123_ONS]
U$1  M3SWA2-34DR+  [16_QFN]

### Nets
+1V8_CLOCK_F: C4.2 C5.2 C6.2 C7.2 C8.2 C9.2 C10.2 C11.2 C12.2 C13.2 C14.2 C293.2 U1.30(AVDD_2) U1.32(AVDD_3) U1.33(AVDD_4) U1.34(AVDD_5) U1.37(AVDD_6) U1.38(AVDD_7) U1.39(AVDD_8) U1.41(AVDD_9) U1.42(AVDD_10) U1.43(AVDD_11) U1.46(AVDD) ; also sheet 1
+1V8_FPGA: C15.2 C16.2 C36.2 R154.1 R155.1 R156.1 R157.1 U1.7(DRVDD_2) U1.24(DRVDD_3) U1.47(DRVDD) ; also sheet 1,2
+3V3_ADAR1_F: ADAR1_.M10(AVDD3_2) ADAR1_.M11(AVDD3_3) ADAR1_.N11(AVDD3) ; also sheet 1
+3V3_ADAR2_F: ADAR2_.M10(AVDD3_2) ADAR2_.M11(AVDD3_3) ADAR2_.N11(AVDD3) R78.1 ; also sheet 1
+3V3_ADAR3_F: ADAR3_.M10(AVDD3_2) ADAR3_.M11(AVDD3_3) ADAR3_.N11(AVDD3) R79.1 ; also sheet 1
+3V3_ADAR4_F: ADAR4_.M10(AVDD3_2) ADAR4_.M11(AVDD3_3) ADAR4_.N11(AVDD3) R80.1 R81.1 ; also sheet 1
+3V3_ADTR: ADTR1107_1.24(VDD_LNA) ADTR1107_2.24(VDD_LNA) ADTR1107_3.24(VDD_LNA) ADTR1107_4.24(VDD_LNA) ADTR1107_5.24(VDD_LNA) ADTR1107_6.24(VDD_LNA) ADTR1107_7.24(VDD_LNA) ADTR1107_8.24(VDD_LNA) ADTR1107_9.24(VDD_LNA) ADTR1107_10.24(VDD_LNA) ADTR1107_11.24(VDD_LNA) ADTR1107_12.24(VDD_LNA) ADTR1107_13.24(VDD_LNA) ADTR1107_14.24(VDD_LNA) ADTR1107_15.24(VDD_LNA) ADTR1107_16.24(VDD_LNA) ; also sheet 1
+3V3_AN: C40.1 C42.1 L6.2 ; also sheet 1
+3V3_AN1_F: U5.9(VCC) ; also sheet 1
+3V3_AN2_F: U13.9(VCC) ; also sheet 1
+3V3_FPGA: C37.1 C41.1 U3.17(REFIO) U3.27(DVDD) ; also sheet 1,2
+3V3_VDD_SW: ADTR1107_1.19(VDD_SW) ADTR1107_2.19(VDD_SW) ADTR1107_3.19(VDD_SW) ADTR1107_4.19(VDD_SW) ADTR1107_5.19(VDD_SW) ADTR1107_6.19(VDD_SW) ADTR1107_7.19(VDD_SW) ADTR1107_8.19(VDD_SW) ADTR1107_9.19(VDD_SW) ADTR1107_10.19(VDD_SW) ADTR1107_11.19(VDD_SW) ADTR1107_12.19(VDD_SW) ADTR1107_13.19(VDD_SW) ADTR1107_14.19(VDD_SW) ADTR1107_15.19(VDD_SW) ADTR1107_16.19(VDD_SW) ; also sheet 1
+3V4: C68.1 C69.1 C81.1 C82.1 C124.1 C125.1 C132.1 C133.1 C139.1 C140.1 C147.1 C148.1 C161.1 C162.1 C169.1 C170.1 C183.1 C196.1 C202.1 C203.1 C209.1 C210.1 C216.1 C217.1 C223.1 C224.1 C230.1 C231.1 C237.1 C238.1 C244.1 C245.1 C251.1 C252.1 RF_SW_1.8(VDD) RF_SW_2.8(VDD) RF_SW_3.8(VDD) RF_SW_4.8(VDD) RF_SW_5.8(VDD) RF_SW_6.8(VDD) RF_SW_7.8(VDD) RF_SW_8.8(VDD) RF_SW_9.8(VDD) RF_SW_10.8(VDD) RF_SW_11.8(VDD) RF_SW_12.8(VDD) RF_SW_13.8(VDD) RF_SW_14.8(VDD) RF_SW_15.8(VDD) RF_SW_16.8(VDD) U14.1(CATHODE) U17.1(CATHODE) U38.1(CATHODE) U40.1(CATHODE) U43.1(CATHODE) U45.1(CATHODE) U47.1(CATHODE) U49.1(CATHODE) U51.1(CATHODE) U53.1(CATHODE) U55.1(CATHODE) U57.1(CATHODE) U59.1(CATHODE) U61.1(CATHODE) U63.1(CATHODE) U65.1(CATHODE) U67.1(CATHODE) U$1.8(VDD) ; also sheet 1
+5V0_0: C352.1 C353.1 U4.8(VCC_2) U4.13(VCC) U4.15(ENB) U8.8(VCC_2) U8.13(VCC) U8.15(ENB) ; also sheet 1
+5V0_PA_1: ADTR1107_1.8(VDD_PA) ADTR1107_2.8(VDD_PA) ADTR1107_3.8(VDD_PA) ADTR1107_4.8(VDD_PA) ADTR1107_7.8(VDD_PA) ; also sheet 1
+5V0_PA_2: ADTR1107_5.8(VDD_PA) ADTR1107_6.8(VDD_PA) ADTR1107_8.8(VDD_PA) ADTR1107_10.8(VDD_PA) ADTR1107_12.8(VDD_PA) ; also sheet 1
+5V0_PA_3: ADTR1107_9.8(VDD_PA) ADTR1107_11.8(VDD_PA) ADTR1107_13.8(VDD_PA) ADTR1107_14.8(VDD_PA) ADTR1107_15.8(VDD_PA) ADTR1107_16.8(VDD_PA) ; also sheet 1
-3V3_SW: ADTR1107_1.21(VSS_SW) ADTR1107_2.21(VSS_SW) ADTR1107_3.21(VSS_SW) ADTR1107_4.21(VSS_SW) ADTR1107_5.21(VSS_SW) ADTR1107_6.21(VSS_SW) ADTR1107_7.21(VSS_SW) ADTR1107_8.21(VSS_SW) ADTR1107_9.21(VSS_SW) ADTR1107_10.21(VSS_SW) ADTR1107_11.21(VSS_SW) ADTR1107_12.21(VSS_SW) ADTR1107_13.21(VSS_SW) ADTR1107_14.21(VSS_SW) ADTR1107_15.21(VSS_SW) ADTR1107_16.21(VSS_SW) ; also sheet 1
-3V4: C66.1 C67.1 C73.1 C74.1 C79.1 C80.1 C130.1 C131.1 C137.1 C138.1 C145.1 C146.1 C152.1 C160.1 C167.1 C168.1 C174.1 C175.1 C200.1 C201.1 C207.1 C208.1 C214.1 C215.1 C221.1 C222.1 C228.1 C229.1 C235.1 C236.1 C242.1 C243.1 C249.1 C250.1 RF_SW_1.5(VEE) RF_SW_2.5(VEE) RF_SW_3.5(VEE) RF_SW_4.5(VEE) RF_SW_5.5(VEE) RF_SW_6.5(VEE) RF_SW_7.5(VEE) RF_SW_8.5(VEE) RF_SW_9.5(VEE) RF_SW_10.5(VEE) RF_SW_11.5(VEE) RF_SW_12.5(VEE) RF_SW_13.5(VEE) RF_SW_14.5(VEE) RF_SW_15.5(VEE) RF_SW_16.5(VEE) U15.2(ANODE) U37.2(ANODE) U39.2(ANODE) U41.2(ANODE) U44.2(ANODE) U46.2(ANODE) U48.2(ANODE) U50.2(ANODE) U52.2(ANODE) U54.2(ANODE) U56.2(ANODE) U58.2(ANODE) U60.2(ANODE) U62.2(ANODE) U64.2(ANODE) U66.2(ANODE) U68.2(ANODE) U$1.5(VEE) ; also sheet 1
-5V0_ADAR12: ADAR1_.B11(AVDD) ADAR2_.B11(AVDD) ; also sheet 1
-5V0_ADAR34: ADAR3_.B11(AVDD) ADAR4_.B11(AVDD) ; also sheet 1
ADAR_1_CS_1V8: ADAR1_.M3(CSB) R154.2 ; also sheet 2
ADAR_2_CS_1V8: ADAR2_.M3(CSB) R155.2 ; also sheet 2
ADAR_3_CS_1V8: ADAR3_.M3(CSB) R156.2 ; also sheet 2
ADAR_4_CS_1V8: ADAR4_.M3(CSB) R157.2 ; also sheet 2
ADAR_RX_LOAD_1: ADAR1_.N2(RX_LOAD) R47.2 ; also sheet 2
ADAR_RX_LOAD_2: ADAR2_.N2(RX_LOAD) R71.2 ; also sheet 2
ADAR_RX_LOAD_3: ADAR3_.N2(RX_LOAD) R74.2 ; also sheet 2
ADAR_RX_LOAD_4: ADAR4_.N2(RX_LOAD) R77.2 ; also sheet 2
ADAR_TR_1: ADAR1_.N6(TR) R158.2 ; also sheet 2
ADAR_TR_2: ADAR2_.N6(TR) R159.2 ; also sheet 2
ADAR_TR_3: ADAR3_.N6(TR) R160.2 ; also sheet 2
ADAR_TR_4: ADAR4_.N6(TR) R161.2 ; also sheet 2
ADAR_TX_LOAD_1: ADAR1_.N3(TX_LOAD) R46.2 ; also sheet 2
ADAR_TX_LOAD_2: ADAR2_.N3(TX_LOAD) R70.2 ; also sheet 2
ADAR_TX_LOAD_3: ADAR3_.N3(TX_LOAD) R73.2 ; also sheet 2
ADAR_TX_LOAD_4: ADAR4_.N3(TX_LOAD) R76.2 ; also sheet 2
ADC_CLK_IN_N [Differential]: C2.1 R173.2 U1.45(CLK-)
ADC_CLK_IN_P [Differential]: C1.1 R173.1 U1.44(CLK+)
ADC_D0_N [Differential]: U1.3(D0-) ; also sheet 2
ADC_D0_P [Differential]: U1.4(D0+) ; also sheet 2
ADC_D1_N [Differential]: U1.5(D1-) ; also sheet 2
ADC_D1_P [Differential]: U1.6(D1+) ; also sheet 2
ADC_D2_N [Differential]: U1.9(D2-) ; also sheet 2
ADC_D2_P [Differential]: U1.10(D2+) ; also sheet 2
ADC_D3_N [Differential]: U1.11(D3-) ; also sheet 2
ADC_D3_P [Differential]: U1.12(D3+) ; also sheet 2
ADC_D4_N [Differential]: U1.13(D4-) ; also sheet 2
ADC_D4_P [Differential]: U1.14(D4+) ; also sheet 2
ADC_D5_N [Differential]: U1.15(D5-) ; also sheet 2
ADC_D5_P [Differential]: U1.16(D5+) ; also sheet 2
ADC_D6_N [Differential]: U1.17(D6-) ; also sheet 2
ADC_D6_P [Differential]: U1.18(D6+) ; also sheet 2
ADC_D7_N [Differential]: U1.19(D7-) ; also sheet 2
ADC_D7_P [Differential]: U1.20(D7+) ; also sheet 2
ADC_DCO_N [Differential]: U1.49(DCO-) ; also sheet 2
ADC_DCO_P [Differential]: U1.50(DCO+) ; also sheet 2
ADC_IF_IN_N [Differential]: C45.2 R1.2 R17.1
ADC_IF_IN_P [Differential]: C44.2 R13.2 R16.2
ADC_OR_N [Differential]: U1.21(OR-) ; also sheet 2
ADC_OR_P [Differential]: U1.22(OR+) ; also sheet 2
ADC_PWRD: R36.2 ; also sheet 2
AMP_IF_IN_N [Differential]: C48.1 C52.2 R21.1
AMP_IF_IN_P [Differential]: C49.2 C51.2 R20.2
AMP_IN_N [Differential]: C57.1 L10.1 R165.1
AMP_IN_P [Differential]: C58.2 L9.1 R166.1
ANT1_1 [Single_Ended Clocks & RF]: ADTR1107_3.17(ANT) C72.2
ANT1_2 [Single_Ended Clocks & RF]: ADTR1107_7.17(ANT) C151.2
ANT1_3 [Single_Ended Clocks & RF]: ADTR1107_10.17(ANT) C206.2
ANT1_4 [Single_Ended Clocks & RF]: ADTR1107_14.17(ANT) C234.2
ANT2_1 [Single_Ended Clocks & RF]: ADTR1107_1.17(ANT) C129.2
ANT2_2 [Single_Ended Clocks & RF]: ADTR1107_5.17(ANT) C166.2
ANT2_3 [Single_Ended Clocks & RF]: ADTR1107_12.17(ANT) C213.2
ANT2_4 [Single_Ended Clocks & RF]: ADTR1107_16.17(ANT) C241.2
ANT3_1 [Single_Ended Clocks & RF]: ADTR1107_2.17(ANT) C136.2
ANT3_2 [Single_Ended Clocks & RF]: ADTR1107_6.17(ANT) C173.2
ANT3_3 [Single_Ended Clocks & RF]: ADTR1107_11.17(ANT) C220.2
ANT3_4 [Single_Ended Clocks & RF]: ADTR1107_15.17(ANT) C248.2
ANT4_1 [Single_Ended Clocks & RF]: ADTR1107_4.17(ANT) C144.2
ANT4_2 [Single_Ended Clocks & RF]: ADTR1107_8.17(ANT) C199.2
ANT4_3 [Single_Ended Clocks & RF]: ADTR1107_9.17(ANT) C227.2
ANT4_4 [Single_Ended Clocks & RF]: ADTR1107_13.17(ANT) C255.2
DAC_0 [Single_Ended Clocks & RF]: R30.1 ; also sheet 2
DAC_1 [Single_Ended Clocks & RF]: R29.1 ; also sheet 2
DAC_2 [Single_Ended Clocks & RF]: R28.1 ; also sheet 2
DAC_3 [Single_Ended Clocks & RF]: R27.1 ; also sheet 2
DAC_4 [Single_Ended Clocks & RF]: R26.1 ; also sheet 2
DAC_5 [Single_Ended Clocks & RF]: R25.1 ; also sheet 2
DAC_6 [Single_Ended Clocks & RF]: R24.1 ; also sheet 2
DAC_7 [Single_Ended Clocks & RF]: R23.1 ; also sheet 2
DAC_ACOM: L7.1 U3.20(ACOM)
DAC_AVDD: C39.2 L6.1 U3.16(REFLO) U3.24(AVDD)
DAC_CLOCK [Single_Ended Clocks & RF]: J20.1 R31.2 U3.28(CLOCK)
DAC_IOUT_F_N [Differential]: C59.2 L27.2 U5.3(IF)
DAC_IOUT_F_P [Differential]: C59.1 L26.2 U5.2(IF+)
DAC_IOUT_N [Differential]: C127.2 C308.1 L25.1 R115.2 U3.21(IOUTB)
DAC_IOUT_P [Differential]: C127.1 C309.1 L22.1 R116.2 U3.22(IOUTA)
DAC_SLEEP: R117.2 U3.15(SLEEP) ; also sheet 2
DET1_1 [Single_Ended Clocks & RF]: ADAR1_.N13(DET1) ADTR1107_3.12(CPLR_OUT)
DET1_2 [Single_Ended Clocks & RF]: ADAR2_.N13(DET1) ADTR1107_7.12(CPLR_OUT)
DET1_3 [Single_Ended Clocks & RF]: ADAR3_.N13(DET1) ADTR1107_10.12(CPLR_OUT)
DET1_4 [Single_Ended Clocks & RF]: ADAR4_.N13(DET1) ADTR1107_14.12(CPLR_OUT)
DET2_1 [Single_Ended Clocks & RF]: ADAR1_.G13(DET2) ADTR1107_1.12(CPLR_OUT)
DET2_2 [Single_Ended Clocks & RF]: ADAR2_.G13(DET2) ADTR1107_5.12(CPLR_OUT)
DET2_3 [Single_Ended Clocks & RF]: ADAR3_.G13(DET2) ADTR1107_12.12(CPLR_OUT)
DET2_4 [Single_Ended Clocks & RF]: ADAR4_.G13(DET2) ADTR1107_16.12(CPLR_OUT)
DET3_1 [Single_Ended Clocks & RF]: ADAR1_.A1(DET3) ADTR1107_2.12(CPLR_OUT)
DET3_2 [Single_Ended Clocks & RF]: ADAR2_.A1(DET3) ADTR1107_6.12(CPLR_OUT)
DET3_3 [Single_Ended Clocks & RF]: ADAR3_.A1(DET3) ADTR1107_11.12(CPLR_OUT)
DET3_4 [Single_Ended Clocks & RF]: ADAR4_.A1(DET3) ADTR1107_15.12(CPLR_OUT)
DET4_1 [Single_Ended Clocks & RF]: ADAR1_.G1(DET4) ADTR1107_4.12(CPLR_OUT)
DET4_2 [Single_Ended Clocks & RF]: ADAR2_.G1(DET4) ADTR1107_8.12(CPLR_OUT)
DET4_3 [Single_Ended Clocks & RF]: ADAR3_.G1(DET4) ADTR1107_9.12(CPLR_OUT)
DET4_4 [Single_Ended Clocks & RF]: ADAR4_.G1(DET4) ADTR1107_13.12(CPLR_OUT)
GND: ADAR1_.89(GND) ADAR1_.A2(GND_2) ADAR1_.A6(GND_3) ADAR1_.A8(GND_4) ADAR1_.A12(GND_5) ADAR1_.A13(GND_6) ADAR1_.B1(GND_7) ADAR1_.B2(GND_8) ADAR1_.B6(GND_9) ADAR1_.B7(GND_10) ADAR1_.B8(GND_11) ADAR1_.B9(GND_12) ADAR1_.B10(GND_13) ADAR1_.B12(GND_14) ADAR1_.B13(GND_15) ADAR1_.C2(GND_16) ADAR1_.C12(GND_17) ADAR1_.D1(GND_18) ADAR1_.D2(GND_19) ADAR1_.D12(GND_20) ADAR1_.D13(GND_21) ADAR1_.E2(GND_22) ADAR1_.E12(GND_23) ADAR1_.F1(GND_24) ADAR1_.F2(GND_25) ADAR1_.F12(GND_26) ADAR1_.F13(GND_27) ADAR1_.G2(GND_28) ADAR1_.G12(GND_29) ADAR1_.H1(GND_30) ADAR1_.H2(GND_31) ADAR1_.H12(GND_32) ADAR1_.H13(GND_33) ADAR1_.J2(GND_34) ADAR1_.J12(GND_35) ADAR1_.K1(GND_36) ADAR1_.K2(GND_37) ADAR1_.K12(GND_38) ADAR1_.K13(GND_39) ADAR1_.L2(GND_40) ADAR1_.L12(GND_41) ADAR1_.M1(GND_42) ADAR1_.M2(GND_43) ADAR1_.M7(GND_44) ADAR1_.M12(GND_45) ADAR1_.M13(GND_46) ADAR1_.N1(GND_47) ADAR1_.N4(ADDR0) ADAR1_.N5(ADDR1) ADAR1_.N7(GND_48) ADAR1_.N8(GND_49) ADAR1_.N12(GND_50) ADAR2_.89(GND) ADAR2_.A2(GND_2) ADAR2_.A6(GND_3) ADAR2_.A8(GND_4) ADAR2_.A12(GND_5) ADAR2_.A13(GND_6) ADAR2_.B1(GND_7) ADAR2_.B2(GND_8) ADAR2_.B6(GND_9) ADAR2_.B7(GND_10) ADAR2_.B8(GND_11) ADAR2_.B9(GND_12) ADAR2_.B10(GND_13) ADAR2_.B12(GND_14) ADAR2_.B13(GND_15) ADAR2_.C2(GND_16) ADAR2_.C12(GND_17) ADAR2_.D1(GND_18) ADAR2_.D2(GND_19) ADAR2_.D12(GND_20) ADAR2_.D13(GND_21) ADAR2_.E2(GND_22) ADAR2_.E12(GND_23) ADAR2_.F1(GND_24) ADAR2_.F2(GND_25) ADAR2_.F12(GND_26) ADAR2_.F13(GND_27) ADAR2_.G2(GND_28) ADAR2_.G12(GND_29) ADAR2_.H1(GND_30) ADAR2_.H2(GND_31) ADAR2_.H12(GND_32) ADAR2_.H13(GND_33) ADAR2_.J2(GND_34) ADAR2_.J12(GND_35) ADAR2_.K1(GND_36) ADAR2_.K2(GND_37) ADAR2_.K12(GND_38) ADAR2_.K13(GND_39) ADAR2_.L2(GND_40) ADAR2_.L12(GND_41) ADAR2_.M1(GND_42) ADAR2_.M2(GND_43) ADAR2_.M7(GND_44) ADAR2_.M12(GND_45) ADAR2_.M13(GND_46) ADAR2_.N1(GND_47) ADAR2_.N4(ADDR0) ADAR2_.N7(GND_48) ADAR2_.N8(GND_49) ADAR2_.N12(GND_50) ADAR3_.89(GND) ADAR3_.A2(GND_2) ADAR3_.A6(GND_3) ADAR3_.A8(GND_4) ADAR3_.A12(GND_5) ADAR3_.A13(GND_6) ADAR3_.B1(GND_7) ADAR3_.B2(GND_8) ADAR3_.B6(GND_9) ADAR3_.B7(GND_10) ADAR3_.B8(GND_11) ADAR3_.B9(GND_12) ADAR3_.B10(GND_13) ADAR3_.B12(GND_14) ADAR3_.B13(GND_15) ADAR3_.C2(GND_16) ADAR3_.C12(GND_17) ADAR3_.D1(GND_18) ADAR3_.D2(GND_19) ADAR3_.D12(GND_20) ADAR3_.D13(GND_21) ADAR3_.E2(GND_22) ADAR3_.E12(GND_23) ADAR3_.F1(GND_24) ADAR3_.F2(GND_25) ADAR3_.F12(GND_26) ADAR3_.F13(GND_27) ADAR3_.G2(GND_28) ADAR3_.G12(GND_29) ADAR3_.H1(GND_30) ADAR3_.H2(GND_31) ADAR3_.H12(GND_32) ADAR3_.H13(GND_33) ADAR3_.J2(GND_34) ADAR3_.J12(GND_35) ADAR3_.K1(GND_36) ADAR3_.K2(GND_37) ADAR3_.K12(GND_38) ADAR3_.K13(GND_39) ADAR3_.L2(GND_40) ADAR3_.L12(GND_41) ADAR3_.M1(GND_42) ADAR3_.M2(GND_43) ADAR3_.M7(GND_44) ADAR3_.M12(GND_45) ADAR3_.M13(GND_46) ADAR3_.N1(GND_47) ADAR3_.N5(ADDR1) ADAR3_.N7(GND_48) ADAR3_.N8(GND_49) ADAR3_.N12(GND_50) ADAR4_.89(GND) ADAR4_.A2(GND_2) ADAR4_.A6(GND_3) ADAR4_.A8(GND_4) ADAR4_.A12(GND_5) ADAR4_.A13(GND_6) ADAR4_.B1(GND_7) ADAR4_.B2(GND_8) ADAR4_.B6(GND_9) ADAR4_.B7(GND_10) ADAR4_.B8(GND_11) ADAR4_.B9(GND_12) ADAR4_.B10(GND_13) ADAR4_.B12(GND_14) ADAR4_.B13(GND_15) ADAR4_.C2(GND_16) ADAR4_.C12(GND_17) ADAR4_.D1(GND_18) ADAR4_.D2(GND_19) ADAR4_.D12(GND_20) ADAR4_.D13(GND_21) ADAR4_.E2(GND_22) ADAR4_.E12(GND_23) ADAR4_.F1(GND_24) ADAR4_.F2(GND_25) ADAR4_.F12(GND_26) ADAR4_.F13(GND_27) ADAR4_.G2(GND_28) ADAR4_.G12(GND_29) ADAR4_.H1(GND_30) ADAR4_.H2(GND_31) ADAR4_.H12(GND_32) ADAR4_.H13(GND_33) ADAR4_.J2(GND_34) ADAR4_.J12(GND_35) ADAR4_.K1(GND_36) ADAR4_.K2(GND_37) ADAR4_.K12(GND_38) ADAR4_.K13(GND_39) ADAR4_.L2(GND_40) ADAR4_.L12(GND_41) ADAR4_.M1(GND_42) ADAR4_.M2(GND_43) ADAR4_.M7(GND_44) ADAR4_.M12(GND_45) ADAR4_.M13(GND_46) ADAR4_.N1(GND_47) ADAR4_.N7(GND_48) ADAR4_.N8(GND_49) ADAR4_.N12(GND_50) ADTR1107_1.1(GND_2) ADTR1107_1.3(GND_3) ADTR1107_1.4(GND_4) ADTR1107_1.6(GND_5) ADTR1107_1.9(NIC_2) ADTR1107_1.10(NIC) ADTR1107_1.11(GND_6) ADTR1107_1.13(GND_7) ADTR1107_1.14(GND_8) ADTR1107_1.15(GND_9) ADTR1107_1.16(GND_10) ADTR1107_1.18(GND_11) ADTR1107_1.22(GND_12) ADTR1107_1.25(GND) ADTR1107_2.1(GND_2) ADTR1107_2.3(GND_3) ADTR1107_2.4(GND_4) ADTR1107_2.6(GND_5) ADTR1107_2.9(NIC_2) ADTR1107_2.10(NIC) ADTR1107_2.11(GND_6) ADTR1107_2.13(GND_7) ADTR1107_2.14(GND_8) ADTR1107_2.15(GND_9) ADTR1107_2.16(GND_10) ADTR1107_2.18(GND_11) ADTR1107_2.22(GND_12) ADTR1107_2.25(GND) ADTR1107_3.1(GND_2) ADTR1107_3.3(GND_3) ADTR1107_3.4(GND_4) ADTR1107_3.6(GND_5) ADTR1107_3.9(NIC_2) ADTR1107_3.10(NIC) ADTR1107_3.11(GND_6) ADTR1107_3.13(GND_7) ADTR1107_3.14(GND_8) ADTR1107_3.15(GND_9) ADTR1107_3.16(GND_10) ADTR1107_3.18(GND_11) ADTR1107_3.22(GND_12) ADTR1107_3.25(GND) ADTR1107_4.1(GND_2) ADTR1107_4.3(GND_3) ADTR1107_4.4(GND_4) ADTR1107_4.6(GND_5) ADTR1107_4.9(NIC_2) ADTR1107_4.10(NIC) ADTR1107_4.11(GND_6) ADTR1107_4.13(GND_7) ADTR1107_4.14(GND_8) ADTR1107_4.15(GND_9) ADTR1107_4.16(GND_10) ADTR1107_4.18(GND_11) ADTR1107_4.22(GND_12) ADTR1107_4.25(GND) ADTR1107_5.1(GND_2) ADTR1107_5.3(GND_3) ADTR1107_5.4(GND_4) ADTR1107_5.6(GND_5) ADTR1107_5.9(NIC_2) ADTR1107_5.10(NIC) ADTR1107_5.11(GND_6) ADTR1107_5.13(GND_7) ADTR1107_5.14(GND_8) ADTR1107_5.15(GND_9) ADTR1107_5.16(GND_10) ADTR1107_5.18(GND_11) ADTR1107_5.22(GND_12) ADTR1107_5.25(GND) ADTR1107_6.1(GND_2) ADTR1107_6.3(GND_3) ADTR1107_6.4(GND_4) ADTR1107_6.6(GND_5) ADTR1107_6.9(NIC_2) ADTR1107_6.10(NIC) ADTR1107_6.11(GND_6) ADTR1107_6.13(GND_7) ADTR1107_6.14(GND_8) ADTR1107_6.15(GND_9) ADTR1107_6.16(GND_10) ADTR1107_6.18(GND_11) ADTR1107_6.22(GND_12) ADTR1107_6.25(GND) ADTR1107_7.1(GND_2) ADTR1107_7.3(GND_3) ADTR1107_7.4(GND_4) ADTR1107_7.6(GND_5) ADTR1107_7.9(NIC_2) ADTR1107_7.10(NIC) ADTR1107_7.11(GND_6) ADTR1107_7.13(GND_7) ADTR1107_7.14(GND_8) ADTR1107_7.15(GND_9) ADTR1107_7.16(GND_10) ADTR1107_7.18(GND_11) ADTR1107_7.22(GND_12) ADTR1107_7.25(GND) ADTR1107_8.1(GND_2) ADTR1107_8.3(GND_3) ADTR1107_8.4(GND_4) ADTR1107_8.6(GND_5) ADTR1107_8.9(NIC_2) ADTR1107_8.10(NIC) ADTR1107_8.11(GND_6) ADTR1107_8.13(GND_7) ADTR1107_8.14(GND_8) ADTR1107_8.15(GND_9) ADTR1107_8.16(GND_10) ADTR1107_8.18(GND_11) ADTR1107_8.22(GND_12) ADTR1107_8.25(GND) ADTR1107_9.1(GND_2) ADTR1107_9.3(GND_3) ADTR1107_9.4(GND_4) ADTR1107_9.6(GND_5) ADTR1107_9.9(NIC_2) ADTR1107_9.10(NIC) ADTR1107_9.11(GND_6) ADTR1107_9.13(GND_7) ADTR1107_9.14(GND_8) ADTR1107_9.15(GND_9) ADTR1107_9.16(GND_10) ADTR1107_9.18(GND_11) ADTR1107_9.22(GND_12) ADTR1107_9.25(GND) ADTR1107_10.1(GND_2) ADTR1107_10.3(GND_3) ADTR1107_10.4(GND_4) ADTR1107_10.6(GND_5) ADTR1107_10.9(NIC_2) ADTR1107_10.10(NIC) ADTR1107_10.11(GND_6) ADTR1107_10.13(GND_7) ADTR1107_10.14(GND_8) ADTR1107_10.15(GND_9) ADTR1107_10.16(GND_10) ADTR1107_10.18(GND_11) ADTR1107_10.22(GND_12) ADTR1107_10.25(GND) ADTR1107_11.1(GND_2) ADTR1107_11.3(GND_3) ADTR1107_11.4(GND_4) ADTR1107_11.6(GND_5) ADTR1107_11.9(NIC_2) ADTR1107_11.10(NIC) ADTR1107_11.11(GND_6) ADTR1107_11.13(GND_7) ADTR1107_11.14(GND_8) ADTR1107_11.15(GND_9) ADTR1107_11.16(GND_10) ADTR1107_11.18(GND_11) ADTR1107_11.22(GND_12) ADTR1107_11.25(GND) ADTR1107_12.1(GND_2) ADTR1107_12.3(GND_3) ADTR1107_12.4(GND_4) ADTR1107_12.6(GND_5) ADTR1107_12.9(NIC_2) ADTR1107_12.10(NIC) ADTR1107_12.11(GND_6) ADTR1107_12.13(GND_7) ADTR1107_12.14(GND_8) ADTR1107_12.15(GND_9) ADTR1107_12.16(GND_10) ADTR1107_12.18(GND_11) ADTR1107_12.22(GND_12) ADTR1107_12.25(GND) ADTR1107_13.1(GND_2) ADTR1107_13.3(GND_3) ADTR1107_13.4(GND_4) ADTR1107_13.6(GND_5) ADTR1107_13.9(NIC_2) ADTR1107_13.10(NIC) ADTR1107_13.11(GND_6) ADTR1107_13.13(GND_7) ADTR1107_13.14(GND_8) ADTR1107_13.15(GND_9) ADTR1107_13.16(GND_10) ADTR1107_13.18(GND_11) ADTR1107_13.22(GND_12) ADTR1107_13.25(GND) ADTR1107_14.1(GND_2) ADTR1107_14.3(GND_3) ADTR1107_14.4(GND_4) ADTR1107_14.6(GND_5) ADTR1107_14.9(NIC_2) ADTR1107_14.10(NIC) ADTR1107_14.11(GND_6) ADTR1107_14.13(GND_7) ADTR1107_14.14(GND_8) ADTR1107_14.15(GND_9) ADTR1107_14.16(GND_10) ADTR1107_14.18(GND_11) ADTR1107_14.22(GND_12) ADTR1107_14.25(GND) ADTR1107_15.1(GND_2) ADTR1107_15.3(GND_3) ADTR1107_15.4(GND_4) ADTR1107_15.6(GND_5) ADTR1107_15.9(NIC_2) ADTR1107_15.10(NIC) ADTR1107_15.11(GND_6) ADTR1107_15.13(GND_7) ADTR1107_15.14(GND_8) ADTR1107_15.15(GND_9) ADTR1107_15.16(GND_10) ADTR1107_15.18(GND_11) ADTR1107_15.22(GND_12) ADTR1107_15.25(GND) ADTR1107_16.1(GND_2) ADTR1107_16.3(GND_3) ADTR1107_16.4(GND_4) ADTR1107_16.6(GND_5) ADTR1107_16.9(NIC_2) ADTR1107_16.10(NIC) ADTR1107_16.11(GND_6) ADTR1107_16.13(GND_7) ADTR1107_16.14(GND_8) ADTR1107_16.15(GND_9) ADTR1107_16.16(GND_10) ADTR1107_16.18(GND_11) ADTR1107_16.22(GND_12) ADTR1107_16.25(GND) C4.1 C5.1 C6.1 C7.1 C8.1 C9.1 C10.1 C11.1 C12.1 C13.1 C14.1 C15.1 C16.1 C36.1 C37.2 C38.2 C40.2 C41.2 C42.2 C46.1 C47.1 C53.1 C56.1 C66.2 C67.2 C68.2 C69.2 C73.2 C74.2 C79.2 C80.2 C81.2 C82.2 C86.2 C87.2 C88.2 C89.2 C90.2 C91.2 C92.2 C93.2 C94.2 C95.2 C96.2 C97.2 C98.2 C99.2 C100.2 C101.2 C102.2 C103.2 C104.2 C105.2 C106.2 C107.2 C114.2 C115.2 C116.2 C117.2 C118.2 C119.2 C120.2 C121.2 C122.2 C123.2 C124.2 C125.2 C130.2 C131.2 C132.2 C133.2 C137.2 C138.2 C139.2 C140.2 C145.2 C146.2 C147.2 C148.2 C152.2 C160.2 C161.2 C162.2 C167.2 C168.2 C169.2 C170.2 C174.2 C175.2 C183.2 C196.2 C200.2 C201.2 C202.2 C203.2 C207.2 C208.2 C209.2 C210.2 C214.2 C215.2 C216.2 C217.2 C221.2 C222.2 C223.2 C224.2 C228.2 C229.2 C230.2 C231.2 C235.2 C236.2 C237.2 C238.2 C242.2 C243.2 C244.2 C245.2 C249.2 C250.2 C251.2 C252.2 C293.1 C308.2 C309.2 C352.2 C353.2 J20.2 J20.3 J20.4 J20.5 J21.MH1 J21.MH2 J21.MH3 J21.MH4 J22.2 J22.3 J22.4 J22.5 J23.2 J23.3 J23.4 J23.5 J24.2 J24.3 J24.4 J24.5 J25.2 J25.3 J25.4 J25.5 J26.2 J26.3 J26.4 J26.5 J27.2 J27.3 J27.4 J27.5 J28.2 J28.3 J28.4 J28.5 J29.2 J29.3 J29.4 J29.5 J30.2 J30.3 J30.4 J30.5 J31.2 J31.3 J31.4 J31.5 J32.2 J32.3 J32.4 J32.5 J33.2 J33.3 J33.4 J33.5 J34.2 J34.3 J34.4 J34.5 J35.2 J35.3 J35.4 J35.5 J36.2 J36.3 J36.4 J36.5 J37.2 J37.3 J37.4 J37.5 J38.2 J38.3 J38.4 J38.5 J39.2 J39.3 J39.4 J39.5 J40.2 J40.3 J40.4 J40.5 J41.2 J41.3 J41.4 J41.5 J42.2 J42.3 J42.4 J42.5 J43.2 J43.3 J43.4 J43.5 J44.2 J44.3 J44.4 J44.5 J45.2 J45.3 J45.4 J45.5 J46.2 J46.3 J46.4 J46.5 J47.2 J47.3 J47.4 J47.5 J48.2 J48.3 J48.4 J48.5 J49.2 J49.3 J49.4 J49.5 J50.2 J50.3 J50.4 J50.5 J51.2 J51.3 J51.4 J51.5 J52.2 J52.3 J52.4 J52.5 J53.2 J53.3 J53.4 J53.5 J54.2 J54.3 J54.4 J54.5 J55.2 J55.3 J55.4 J55.5 L7.2 R31.1 R33.2 R37.1 R38.1 R45.2 R46.1 R47.1 R48.2 R55.2 R56.2 R57.2 R58.2 R70.1 R71.1 R72.2 R73.1 R74.1 R75.2 R76.1 R77.1 R115.1 R116.1 R117.1 R158.1 R159.1 R160.1 R161.1 R162.1 R163.1 R164.1 R165.2 R166.2 RF_SW_1.1(NC) RF_SW_1.2(GND) RF_SW_1.4(GND2) RF_SW_1.7(GND3) RF_SW_1.9(GND4) RF_SW_1.11(GND5) RF_SW_1.12(NC2) RF_SW_1.13(NC3) RF_SW_1.14(GND6) RF_SW_1.16(GND7) RF_SW_1.17(EP) RF_SW_2.1(NC) RF_SW_2.2(GND) RF_SW_2.4(GND2) RF_SW_2.7(GND3) RF_SW_2.9(GND4) RF_SW_2.11(GND5) RF_SW_2.12(NC2) RF_SW_2.13(NC3) RF_SW_2.14(GND6) RF_SW_2.16(GND7) RF_SW_2.17(EP) RF_SW_3.1(NC) RF_SW_3.2(GND) RF_SW_3.4(GND2) RF_SW_3.7(GND3) RF_SW_3.9(GND4) RF_SW_3.11(GND5) RF_SW_3.12(NC2) RF_SW_3.13(NC3) RF_SW_3.14(GND6) RF_SW_3.16(GND7) RF_SW_3.17(EP) RF_SW_4.1(NC) RF_SW_4.2(GND) RF_SW_4.4(GND2) RF_SW_4.7(GND3) RF_SW_4.9(GND4) RF_SW_4.11(GND5) RF_SW_4.12(NC2) RF_SW_4.13(NC3) RF_SW_4.14(GND6) RF_SW_4.16(GND7) RF_SW_4.17(EP) RF_SW_5.1(NC) RF_SW_5.2(GND) RF_SW_5.4(GND2) RF_SW_5.7(GND3) RF_SW_5.9(GND4) RF_SW_5.11(GND5) RF_SW_5.12(NC2) RF_SW_5.13(NC3) RF_SW_5.14(GND6) RF_SW_5.16(GND7) RF_SW_5.17(EP) RF_SW_6.1(NC) RF_SW_6.2(GND) RF_SW_6.4(GND2) RF_SW_6.7(GND3) RF_SW_6.9(GND4) RF_SW_6.11(GND5) RF_SW_6.12(NC2) RF_SW_6.13(NC3) RF_SW_6.14(GND6) RF_SW_6.16(GND7) RF_SW_6.17(EP) RF_SW_7.1(NC) RF_SW_7.2(GND) RF_SW_7.4(GND2) RF_SW_7.7(GND3) RF_SW_7.9(GND4) RF_SW_7.11(GND5) RF_SW_7.12(NC2) RF_SW_7.13(NC3) RF_SW_7.14(GND6) RF_SW_7.16(GND7) RF_SW_7.17(EP) RF_SW_8.1(NC) RF_SW_8.2(GND) RF_SW_8.4(GND2) RF_SW_8.7(GND3) RF_SW_8.9(GND4) RF_SW_8.11(GND5) RF_SW_8.12(NC2) RF_SW_8.13(NC3) RF_SW_8.14(GND6) RF_SW_8.16(GND7) RF_SW_8.17(EP) RF_SW_9.1(NC) RF_SW_9.2(GND) RF_SW_9.4(GND2) RF_SW_9.7(GND3) RF_SW_9.9(GND4) RF_SW_9.11(GND5) RF_SW_9.12(NC2) RF_SW_9.13(NC3) RF_SW_9.14(GND6) RF_SW_9.16(GND7) RF_SW_9.17(EP) RF_SW_10.1(NC) RF_SW_10.2(GND) RF_SW_10.4(GND2) RF_SW_10.7(GND3) RF_SW_10.9(GND4) RF_SW_10.11(GND5) RF_SW_10.12(NC2) RF_SW_10.13(NC3) RF_SW_10.14(GND6) RF_SW_10.16(GND7) RF_SW_10.17(EP) RF_SW_11.1(NC) RF_SW_11.2(GND) RF_SW_11.4(GND2) RF_SW_11.7(GND3) RF_SW_11.9(GND4) RF_SW_11.11(GND5) RF_SW_11.12(NC2) RF_SW_11.13(NC3) RF_SW_11.14(GND6) RF_SW_11.16(GND7) RF_SW_11.17(EP) RF_SW_12.1(NC) RF_SW_12.2(GND) RF_SW_12.4(GND2) RF_SW_12.7(GND3) RF_SW_12.9(GND4) RF_SW_12.11(GND5) RF_SW_12.12(NC2) RF_SW_12.13(NC3) RF_SW_12.14(GND6) RF_SW_12.16(GND7) RF_SW_12.17(EP) RF_SW_13.1(NC) RF_SW_13.2(GND) RF_SW_13.4(GND2) RF_SW_13.7(GND3) RF_SW_13.9(GND4) RF_SW_13.11(GND5) RF_SW_13.12(NC2) RF_SW_13.13(NC3) RF_SW_13.14(GND6) RF_SW_13.16(GND7) RF_SW_13.17(EP) RF_SW_14.1(NC) RF_SW_14.2(GND) RF_SW_14.4(GND2) RF_SW_14.7(GND3) RF_SW_14.9(GND4) RF_SW_14.11(GND5) RF_SW_14.12(NC2) RF_SW_14.13(NC3) RF_SW_14.14(GND6) RF_SW_14.16(GND7) RF_SW_14.17(EP) RF_SW_15.1(NC) RF_SW_15.2(GND) RF_SW_15.4(GND2) RF_SW_15.7(GND3) RF_SW_15.9(GND4) RF_SW_15.11(GND5) RF_SW_15.12(NC2) RF_SW_15.13(NC3) RF_SW_15.14(GND6) RF_SW_15.16(GND7) RF_SW_15.17(EP) RF_SW_16.1(NC) RF_SW_16.2(GND) RF_SW_16.4(GND2) RF_SW_16.7(GND3) RF_SW_16.9(GND4) RF_SW_16.11(GND5) RF_SW_16.12(NC2) RF_SW_16.13(NC3) RF_SW_16.14(GND6) RF_SW_16.16(GND7) RF_SW_16.17(EP) SJ1.1 U1.8(DRGND_2) U1.23(DRGND_3) U1.48(DRGND) U1.57(EPAD) U3.26(DCOM) U4.6(GND_2) U4.7(GND_3) U4.9(GND_4) U4.12(GND) U4.17(EPAD) U5.1(GND_2) U5.4(GND_3) U5.6(GND_4) U5.8(GND_5) U5.10(GND_6) U5.12(GND) U8.6(GND_2) U8.7(GND_3) U8.9(GND_4) U8.12(GND) U8.17(EPAD) U13.1(GND_2) U13.4(GND_3) U13.6(GND_4) U13.8(GND_5) U13.10(GND_6) U13.12(GND) U14.2(ANODE) U15.1(CATHODE) U16.1(NOT_USED) U16.2(NOT_USED_2) U16.3(NOT_USED_3) U16.4(NOT_USED_4) U16.5(NOT_USED_5) U16.6(NOT_USED_6) U16.7(NOT_USED_7) U16.8(NOT_USED_8) U16.9(GROUND_2) U16.11(GROUND_3) U16.12(NOT_USED_9) U16.13(GROUND_4) U16.15(GROUND_5) U16.16(NOT_USED_10) U16.17(NOT_USED_11) U16.18(NOT_USED_12) U16.19(NOT_USED_13) U16.20(GROUND_6) U16.22(GROUND_7) U16.23(NOT_USED_14) U16.24(NOT_USED_15) U16.25(NOT_USED_16) U16.26(GROUND_8) U16.28(GROUND_9) U16.29(NOT_USED_17) U16.30(GROUND_10) U16.32(GROUND_11) U16.33(GROUND) U17.2(ANODE) U37.1(CATHODE) U38.2(ANODE) U39.1(CATHODE) U40.2(ANODE) U41.1(CATHODE) U43.2(ANODE) U44.1(CATHODE) U45.2(ANODE) U46.1(CATHODE) U47.2(ANODE) U48.1(CATHODE) U49.2(ANODE) U50.1(CATHODE) U51.2(ANODE) U52.1(CATHODE) U53.2(ANODE) U54.1(CATHODE) U55.2(ANODE) U56.1(CATHODE) U57.2(ANODE) U58.1(CATHODE) U59.2(ANODE) U60.1(CATHODE) U61.2(ANODE) U62.1(CATHODE) U63.2(ANODE) U64.1(CATHODE) U65.2(ANODE) U66.1(CATHODE) U67.2(ANODE) U68.1(CATHODE) U$1.1(NC) U$1.2(GND) U$1.4(GND2) U$1.7(GND3) U$1.9(GND4) U$1.11(GND5) U$1.12(NC2) U$1.13(NC3) U$1.14(GND6) U$1.16(GND7) U$1.17(EP) ; also sheet 1,2,4
LNA_BIAS_1: ADAR1_.A11(LNA_BIAS) ADTR1107_1.23(VGG_LNA) ADTR1107_2.23(VGG_LNA) ADTR1107_3.23(VGG_LNA) ADTR1107_4.23(VGG_LNA)
LNA_BIAS_2: ADAR2_.A11(LNA_BIAS) ADTR1107_5.23(VGG_LNA) ADTR1107_6.23(VGG_LNA) ADTR1107_7.23(VGG_LNA) ADTR1107_8.23(VGG_LNA)
LNA_BIAS_3: ADAR3_.A11(LNA_BIAS) ADTR1107_9.23(VGG_LNA) ADTR1107_10.23(VGG_LNA) ADTR1107_11.23(VGG_LNA) ADTR1107_12.23(VGG_LNA)
LNA_BIAS_4: ADAR4_.A11(LNA_BIAS) ADTR1107_13.23(VGG_LNA) ADTR1107_14.23(VGG_LNA) ADTR1107_15.23(VGG_LNA) ADTR1107_16.23(VGG_LNA)
M3S_VCTRL: RF_SW_1.6(VCTRL) RF_SW_2.6(VCTRL) RF_SW_3.6(VCTRL) RF_SW_4.6(VCTRL) RF_SW_5.6(VCTRL) RF_SW_6.6(VCTRL) RF_SW_7.6(VCTRL) RF_SW_8.6(VCTRL) RF_SW_9.6(VCTRL) RF_SW_10.6(VCTRL) RF_SW_11.6(VCTRL) RF_SW_12.6(VCTRL) RF_SW_13.6(VCTRL) RF_SW_14.6(VCTRL) RF_SW_15.6(VCTRL) RF_SW_16.6(VCTRL) U$1.6(VCTRL) ; also sheet 2
MIX_RX_EN: U13.7(EN) ; also sheet 2
MIX_RX_N [Differential]: C270.2 U13.3(IF)
MIX_RX_P [Differential]: C268.2 U13.2(IF+)
MIX_TX_EN: U5.7(EN) ; also sheet 2
N$2_N [Differential]: C2.2 J21.2
N$2_P [Differential]: C1.2 J21.1
N$4: C3.1 R1.1 U1.36(VIN-)
N$5: C43.2 R15.2 U4.1(RDP)
N$10: R23.2 U3.1(DB7)
N$11: R24.2 U3.2(DB6)
N$12: R25.2 U3.3(DB5)
N$13: R26.2 U3.4(DB4)
N$14: R27.2 U3.5(DB3)
N$15: C43.1 R15.1 U4.4(RDN)
N$16: R28.2 U3.6(DB2)
N$17: R38.2 U1.31(VREF)
N$18: R29.2 U3.7(DB1)
N$19: R30.2 U3.8(DB0)
N$20 [Single_Ended Clocks & RF]: C272.1 U5.11(LO)
N$21 [Single_Ended Clocks & RF]: C83.2 U$1.3(RFOUT1)
N$22: R33.1 U3.18(FSADJ)
N$23 [Single_Ended Clocks & RF]: C272.2 J23.1
N$24 [Single_Ended Clocks & RF]: C274.2 J22.1
N$26 [Single_Ended Clocks & RF]: C85.1 U$1.15(RFC)
N$35: R14.1 U4.3(RGN)
N$37: C38.1 U3.23(COMP2)
N$38 [Single_Ended Clocks & RF]: C84.1 U$1.10(RFOUT2)
N$39: ADAR1_.B3(PA_ON) R45.1
N$40: ADAR2_.B3(PA_ON) R48.1
N$41: R36.1 R37.2 U1.29(PWDN)
N$42: ADAR2_.M9(CREG2) C87.1
N$43: C3.2 R13.1 U1.35(VIN+)
N$44: U1.40(CML)
N$45: ADAR2_.M8(CREG1) C86.1
N$46: ADAR2_.N10(CREG3) C92.1
N$48: R14.2 U4.2(RGP)
N$49: R19.1 U4.5(VIN)
N$50: R18.2 U4.16(VIP)
N$51: C47.2 U4.14(VCM)
N$53: ADAR2_.N9(CREG4) C93.1
N$56: C44.1 U4.11(VOP)
N$57: ADAR3_.B3(PA_ON) R72.1
N$58: C61.1 L3.2
N$59: ADAR3_.M9(CREG2) C95.1
N$60: ADAR3_.M8(CREG1) C94.1
N$61: ADAR3_.N10(CREG3) C96.1
N$62: C62.1 L4.2
N$63: ADAR3_.N9(CREG4) C97.1
N$64: ADAR4_.B3(PA_ON) R75.1
N$65: C45.1 U4.10(VON)
N$66: ADAR1_.N9(CREG4) C91.1
N$67: C46.2 R16.1 R17.2
N$68: ADAR4_.M9(CREG2) C99.1
N$69: ADAR4_.M8(CREG1) C98.1
N$70: ADAR4_.N10(CREG3) C100.1
N$71: C64.1 L9.2
N$72 [Single_Ended Clocks & RF]: C274.1 U13.11(LO)
N$73: C48.2 R19.2
N$74 [Single_Ended Clocks & RF]: C70.2 RF_SW_3.3(RFOUT1)
N$75: ADAR4_.N9(CREG4) C101.1
N$76: ADAR1_.M9(CREG2) C89.1
N$77: ADAR1_.M8(CREG1) C88.1
N$78: C49.1 R18.1
N$79: ADAR1_.N10(CREG3) C90.1
N$80: ADAR2_.N5(ADDR1) R55.1 R78.2
N$81: ADAR3_.N4(ADDR0) R56.1 R79.2
N$82: C65.1 L10.2
N$83: ADAR4_.N5(ADDR1) R58.1 R81.2
N$84: ADAR4_.N4(ADDR0) R57.1 R80.2
N$85: C54.2 R32.2 U8.1(RDP)
N$86: C54.1 R32.1 U8.4(RDN)
N$87: R22.1 U8.3(RGN)
N$88: R22.2 U8.2(RGP)
N$89: R35.1 U8.5(VIN)
N$96: C39.1 U3.19(COMP1)
N$99: C141.1 L22.2 L26.1
N$100 [Single_Ended Clocks & RF]: C72.1 RF_SW_3.15(RFC)
N$101: C141.2 L25.2 L27.1
N$102: C56.2 U8.14(VCM)
N$103: R34.2 U8.16(VIP)
N$104: C51.1 U8.11(VOP)
N$105: C52.1 U8.10(VON)
N$110: C53.2 R20.1 R21.2
N$111: C57.2 R35.2
N$112: C58.1 R34.1
N$113: C63.1 C64.2 L3.1 L8.2
N$125: C63.2 C65.2 L4.1 L8.1
N$127 [Single_Ended Clocks & RF]: C71.1 RF_SW_3.10(RFOUT2)
N$128 [Single_Ended Clocks & RF]: C70.1 J25.1
N$129 [Single_Ended Clocks & RF]: C71.2 J24.1
N$130 [Single_Ended Clocks & RF]: C126.2 RF_SW_1.3(RFOUT1)
N$131 [Single_Ended Clocks & RF]: C129.1 RF_SW_1.15(RFC)
N$132 [Single_Ended Clocks & RF]: C128.1 RF_SW_1.10(RFOUT2)
N$133 [Single_Ended Clocks & RF]: C126.1 J27.1
N$134 [Single_Ended Clocks & RF]: C128.2 J26.1
N$135 [Single_Ended Clocks & RF]: C134.2 RF_SW_2.3(RFOUT1)
N$136 [Single_Ended Clocks & RF]: C136.1 RF_SW_2.15(RFC)
N$137 [Single_Ended Clocks & RF]: C135.1 RF_SW_2.10(RFOUT2)
N$138 [Single_Ended Clocks & RF]: C134.1 J29.1
N$139 [Single_Ended Clocks & RF]: C135.2 J28.1
N$140 [Single_Ended Clocks & RF]: C142.2 RF_SW_4.3(RFOUT1)
N$141 [Single_Ended Clocks & RF]: C144.1 RF_SW_4.15(RFC)
N$142 [Single_Ended Clocks & RF]: C143.1 RF_SW_4.10(RFOUT2)
N$143 [Single_Ended Clocks & RF]: C142.1 J31.1
N$144 [Single_Ended Clocks & RF]: C143.2 J30.1
N$145 [Single_Ended Clocks & RF]: C149.2 RF_SW_7.3(RFOUT1)
N$146 [Single_Ended Clocks & RF]: C151.1 RF_SW_7.15(RFC)
N$147 [Single_Ended Clocks & RF]: C150.1 RF_SW_7.10(RFOUT2)
N$148 [Single_Ended Clocks & RF]: C149.1 J33.1
N$149 [Single_Ended Clocks & RF]: C150.2 J32.1
N$150 [Single_Ended Clocks & RF]: C163.2 RF_SW_5.3(RFOUT1)
N$151 [Single_Ended Clocks & RF]: C166.1 RF_SW_5.15(RFC)
N$152 [Single_Ended Clocks & RF]: C165.1 RF_SW_5.10(RFOUT2)
N$153 [Single_Ended Clocks & RF]: C163.1 J35.1
N$154 [Single_Ended Clocks & RF]: C165.2 J34.1
N$155 [Single_Ended Clocks & RF]: C171.2 RF_SW_6.3(RFOUT1)
N$156 [Single_Ended Clocks & RF]: C173.1 RF_SW_6.15(RFC)
N$157 [Single_Ended Clocks & RF]: C172.1 RF_SW_6.10(RFOUT2)
N$158 [Single_Ended Clocks & RF]: C171.1 J37.1
N$159 [Single_Ended Clocks & RF]: C172.2 J36.1
N$160 [Single_Ended Clocks & RF]: C197.2 RF_SW_8.3(RFOUT1)
N$161 [Single_Ended Clocks & RF]: C199.1 RF_SW_8.15(RFC)
N$162 [Single_Ended Clocks & RF]: C198.1 RF_SW_8.10(RFOUT2)
N$163 [Single_Ended Clocks & RF]: C197.1 J39.1
N$164 [Single_Ended Clocks & RF]: C198.2 J38.1
N$165 [Single_Ended Clocks & RF]: C204.2 RF_SW_10.3(RFOUT1)
N$166 [Single_Ended Clocks & RF]: C206.1 RF_SW_10.15(RFC)
N$167 [Single_Ended Clocks & RF]: C205.1 RF_SW_10.10(RFOUT2)
N$168 [Single_Ended Clocks & RF]: C204.1 J41.1
N$169 [Single_Ended Clocks & RF]: C205.2 J40.1
N$170 [Single_Ended Clocks & RF]: C211.2 RF_SW_12.3(RFOUT1)
N$171 [Single_Ended Clocks & RF]: C213.1 RF_SW_12.15(RFC)
N$172 [Single_Ended Clocks & RF]: C212.1 RF_SW_12.10(RFOUT2)
N$173 [Single_Ended Clocks & RF]: C211.1 J43.1
N$174 [Single_Ended Clocks & RF]: C212.2 J42.1
N$175 [Single_Ended Clocks & RF]: C218.2 RF_SW_11.3(RFOUT1)
N$176 [Single_Ended Clocks & RF]: C220.1 RF_SW_11.15(RFC)
N$177 [Single_Ended Clocks & RF]: C219.1 RF_SW_11.10(RFOUT2)
N$178 [Single_Ended Clocks & RF]: C218.1 J45.1
N$179 [Single_Ended Clocks & RF]: C219.2 J44.1
N$180 [Single_Ended Clocks & RF]: C225.2 RF_SW_9.3(RFOUT1)
N$181 [Single_Ended Clocks & RF]: C227.1 RF_SW_9.15(RFC)
N$182 [Single_Ended Clocks & RF]: C226.1 RF_SW_9.10(RFOUT2)
N$183 [Single_Ended Clocks & RF]: C225.1 J47.1
N$184 [Single_Ended Clocks & RF]: C226.2 J46.1
N$185 [Single_Ended Clocks & RF]: C232.2 RF_SW_14.3(RFOUT1)
N$186 [Single_Ended Clocks & RF]: C234.1 RF_SW_14.15(RFC)
N$187 [Single_Ended Clocks & RF]: C233.1 RF_SW_14.10(RFOUT2)
N$188 [Single_Ended Clocks & RF]: C232.1 J49.1
N$189 [Single_Ended Clocks & RF]: C233.2 J48.1
N$190 [Single_Ended Clocks & RF]: C239.2 RF_SW_16.3(RFOUT1)
N$191 [Single_Ended Clocks & RF]: C241.1 RF_SW_16.15(RFC)
N$192 [Single_Ended Clocks & RF]: C240.1 RF_SW_16.10(RFOUT2)
N$193 [Single_Ended Clocks & RF]: C239.1 J51.1
N$194 [Single_Ended Clocks & RF]: C240.2 J50.1
N$195 [Single_Ended Clocks & RF]: C246.2 RF_SW_15.3(RFOUT1)
N$196 [Single_Ended Clocks & RF]: C248.1 RF_SW_15.15(RFC)
N$197 [Single_Ended Clocks & RF]: C247.1 RF_SW_15.10(RFOUT2)
N$198 [Single_Ended Clocks & RF]: C246.1 J53.1
N$199 [Single_Ended Clocks & RF]: C247.2 J52.1
N$200 [Single_Ended Clocks & RF]: C253.2 RF_SW_13.3(RFOUT1)
N$201 [Single_Ended Clocks & RF]: C255.1 RF_SW_13.15(RFC)
N$202 [Single_Ended Clocks & RF]: C254.1 RF_SW_13.10(RFOUT2)
N$203 [Single_Ended Clocks & RF]: C253.1 J55.1
N$204 [Single_Ended Clocks & RF]: C254.2 J54.1
N$300: C60.1 C61.2 L2.2 L24.1
N$305: C60.2 C62.2 L2.1 L28.1
N$308 [Single_Ended Clocks & RF]: C268.1 L24.2
N$309 [Single_Ended Clocks & RF]: C270.1 L28.2
PA_BIAS1_1: ADAR1_.A10(PA_BIAS1) ADTR1107_3.7(VGG_PA) C103.1
PA_BIAS1_2: ADAR2_.A10(PA_BIAS1) ADTR1107_7.7(VGG_PA) C107.1
PA_BIAS1_3: ADAR3_.A10(PA_BIAS1) ADTR1107_10.7(VGG_PA) C116.1
PA_BIAS1_4: ADAR4_.A10(PA_BIAS1) ADTR1107_14.7(VGG_PA) C120.1
PA_BIAS2_1: ADAR1_.A9(PA_BIAS2) ADTR1107_1.7(VGG_PA) C102.1
PA_BIAS2_2: ADAR2_.A9(PA_BIAS2) ADTR1107_5.7(VGG_PA) C106.1
PA_BIAS2_3: ADAR3_.A9(PA_BIAS2) ADTR1107_12.7(VGG_PA) C117.1
PA_BIAS2_4: ADAR4_.A9(PA_BIAS2) ADTR1107_16.7(VGG_PA) C121.1
PA_BIAS3_1: ADAR1_.A5(PA_BIAS3) ADTR1107_2.7(VGG_PA) C105.1
PA_BIAS3_2: ADAR2_.A5(PA_BIAS3) ADTR1107_6.7(VGG_PA) C114.1
PA_BIAS3_3: ADAR3_.A5(PA_BIAS3) ADTR1107_11.7(VGG_PA) C118.1
PA_BIAS3_4: ADAR4_.A5(PA_BIAS3) ADTR1107_15.7(VGG_PA) C122.1
PA_BIAS4_1: ADAR1_.A4(PA_BIAS4) ADTR1107_4.7(VGG_PA) C104.1
PA_BIAS4_2: ADAR2_.A4(PA_BIAS4) ADTR1107_8.7(VGG_PA) C115.1
PA_BIAS4_3: ADAR3_.A4(PA_BIAS4) ADTR1107_9.7(VGG_PA) C119.1
PA_BIAS4_4: ADAR4_.A4(PA_BIAS4) ADTR1107_13.7(VGG_PA) C123.1
RF_IO [Single_Ended Clocks & RF]: C85.2 U16.21(SUM_PORT)
RF_IO_1 [Single_Ended Clocks & RF]: ADAR1_.A7(RF_IO) U16.14(PORT_1)
RF_IO_2 [Single_Ended Clocks & RF]: ADAR2_.A7(RF_IO) U16.10(PORT_2)
RF_IO_3 [Single_Ended Clocks & RF]: ADAR3_.A7(RF_IO) U16.31(PORT_3)
RF_IO_4 [Single_Ended Clocks & RF]: ADAR4_.A7(RF_IO) U16.27(PORT_4)
RF_RX [Single_Ended Clocks & RF]: J58.1 R175.1 U13.5(RF)
RF_RX_FIL [Single_Ended Clocks & RF]: C84.2 J59.1 R175.2
RF_TX [Single_Ended Clocks & RF]: J57.1 R174.2 U5.5(RF)
RF_TX_FIL [Single_Ended Clocks & RF]: C83.1 J56.1 R174.1
RX1_1 [Single_Ended Clocks & RF]: ADAR1_.J13(RX1) ADTR1107_3.2(RX_OUT)
RX1_2 [Single_Ended Clocks & RF]: ADAR2_.J13(RX1) ADTR1107_7.2(RX_OUT)
RX1_3 [Single_Ended Clocks & RF]: ADAR3_.J13(RX1) ADTR1107_10.2(RX_OUT)
RX1_4 [Single_Ended Clocks & RF]: ADAR4_.J13(RX1) ADTR1107_14.2(RX_OUT)
RX2_1 [Single_Ended Clocks & RF]: ADAR1_.C13(RX2) ADTR1107_1.2(RX_OUT)
RX2_2 [Single_Ended Clocks & RF]: ADAR2_.C13(RX2) ADTR1107_5.2(RX_OUT)
RX2_3 [Single_Ended Clocks & RF]: ADAR3_.C13(RX2) ADTR1107_12.2(RX_OUT)
RX2_4 [Single_Ended Clocks & RF]: ADAR4_.C13(RX2) ADTR1107_16.2(RX_OUT)
RX3_1 [Single_Ended Clocks & RF]: ADAR1_.E1(RX3) ADTR1107_2.2(RX_OUT)
RX3_2 [Single_Ended Clocks & RF]: ADAR2_.E1(RX3) ADTR1107_6.2(RX_OUT)
RX3_3 [Single_Ended Clocks & RF]: ADAR3_.E1(RX3) ADTR1107_11.2(RX_OUT)
RX3_4 [Single_Ended Clocks & RF]: ADAR4_.E1(RX3) ADTR1107_15.2(RX_OUT)
RX4_1 [Single_Ended Clocks & RF]: ADAR1_.L1(RX4) ADTR1107_4.2(RX_OUT)
RX4_2 [Single_Ended Clocks & RF]: ADAR2_.L1(RX4) ADTR1107_8.2(RX_OUT)
RX4_3 [Single_Ended Clocks & RF]: ADAR3_.L1(RX4) ADTR1107_9.2(RX_OUT)
RX4_4 [Single_Ended Clocks & RF]: ADAR4_.L1(RX4) ADTR1107_13.2(RX_OUT)
STM32_MISO_1V8: ADAR1_.M4(SDO) ADAR2_.M4(SDO) ADAR3_.M4(SDO) ADAR4_.M4(SDO) R164.2 ; also sheet 2
STM32_MOSI_1V8: ADAR1_.M5(SDIO) ADAR2_.M5(SDIO) ADAR3_.M5(SDIO) ADAR4_.M5(SDIO) R163.2 ; also sheet 2
STM32_SCLK_1V8 [Single_Ended Clocks & RF]: ADAR1_.M6(SCLK) ADAR2_.M6(SCLK) ADAR3_.M6(SCLK) ADAR4_.M6(SCLK) R162.2 ; also sheet 2
TR_SW_POS_1: ADAR1_.B5(TR_SW_POS) ADTR1107_1.20(CTRL_SW) ADTR1107_2.20(CTRL_SW) ADTR1107_3.20(CTRL_SW) ADTR1107_4.20(CTRL_SW)
TR_SW_POS_2: ADAR2_.B5(TR_SW_POS) ADTR1107_5.20(CTRL_SW) ADTR1107_6.20(CTRL_SW) ADTR1107_7.20(CTRL_SW) ADTR1107_8.20(CTRL_SW)
TR_SW_POS_3: ADAR3_.B5(TR_SW_POS) ADTR1107_9.20(CTRL_SW) ADTR1107_10.20(CTRL_SW) ADTR1107_11.20(CTRL_SW) ADTR1107_12.20(CTRL_SW)
TR_SW_POS_4: ADAR4_.B5(TR_SW_POS) ADTR1107_13.20(CTRL_SW) ADTR1107_14.20(CTRL_SW) ADTR1107_15.20(CTRL_SW) ADTR1107_16.20(CTRL_SW)
TX1_1 [Single_Ended Clocks & RF]: ADAR1_.L13(TX1) ADTR1107_3.5(TX_IN)
TX1_2 [Single_Ended Clocks & RF]: ADAR2_.L13(TX1) ADTR1107_7.5(TX_IN)
TX1_3 [Single_Ended Clocks & RF]: ADAR3_.L13(TX1) ADTR1107_10.5(TX_IN)
TX1_4 [Single_Ended Clocks & RF]: ADAR4_.L13(TX1) ADTR1107_14.5(TX_IN)
TX2_1 [Single_Ended Clocks & RF]: ADAR1_.E13(TX2) ADTR1107_1.5(TX_IN)
TX2_2 [Single_Ended Clocks & RF]: ADAR2_.E13(TX2) ADTR1107_5.5(TX_IN)
TX2_3 [Single_Ended Clocks & RF]: ADAR3_.E13(TX2) ADTR1107_12.5(TX_IN)
TX2_4 [Single_Ended Clocks & RF]: ADAR4_.E13(TX2) ADTR1107_16.5(TX_IN)
TX3_1 [Single_Ended Clocks & RF]: ADAR1_.C1(TX3) ADTR1107_2.5(TX_IN)
TX3_2 [Single_Ended Clocks & RF]: ADAR2_.C1(TX3) ADTR1107_6.5(TX_IN)
TX3_3 [Single_Ended Clocks & RF]: ADAR3_.C1(TX3) ADTR1107_11.5(TX_IN)
TX3_4 [Single_Ended Clocks & RF]: ADAR4_.C1(TX3) ADTR1107_15.5(TX_IN)
TX4_1 [Single_Ended Clocks & RF]: ADAR1_.J1(TX4) ADTR1107_4.5(TX_IN)
TX4_2 [Single_Ended Clocks & RF]: ADAR2_.J1(TX4) ADTR1107_8.5(TX_IN)
TX4_3 [Single_Ended Clocks & RF]: ADAR3_.J1(TX4) ADTR1107_9.5(TX_IN)
TX4_4 [Single_Ended Clocks & RF]: ADAR4_.J1(TX4) ADTR1107_13.5(TX_IN)
Unconnected: ADAR1_.A3(TR_SW_NEG) ADAR1_.B4(TR_POL) ADAR2_.A3(TR_SW_NEG) ADAR2_.B4(TR_POL) ADAR3_.A3(TR_SW_NEG) ADAR3_.B4(TR_POL) ADAR4_.A3(TR_SW_NEG) ADAR4_.B4(TR_POL) U1.1(DNC_2) U1.2(DNC_3) U1.28(DNC_4) U1.51(DNC_5) U1.52(DNC_6) U1.53(DNC_7) U1.54(DNC_8) U1.55(DNC_9) U1.56(DNC) U3.9(NC_2) U3.10(NC_3) U3.11(NC_4) U3.12(NC_5) U3.13(NC_6) U3.14(NC_7) U3.25(NC)

### Notes on the sheet
- TX CHAIN: DAC -> RECONSTRUCTION FILTER -> MIXER -> STUB BPF
- TX RX RF SWITCH <-> SPLITTER/COMBINER
- RX CHAIN: ADC <- 2nd STAGE AMPLIFIER(10dB) <- 1st STAGE AMPLIFIER(15dB) <- IF LPF <- MIXER <- STUB BPF